# Altium project Minion_Rev2.PrjPCB (part 5 of 5)

## Sheet VDD_GND.SchDoc
size E
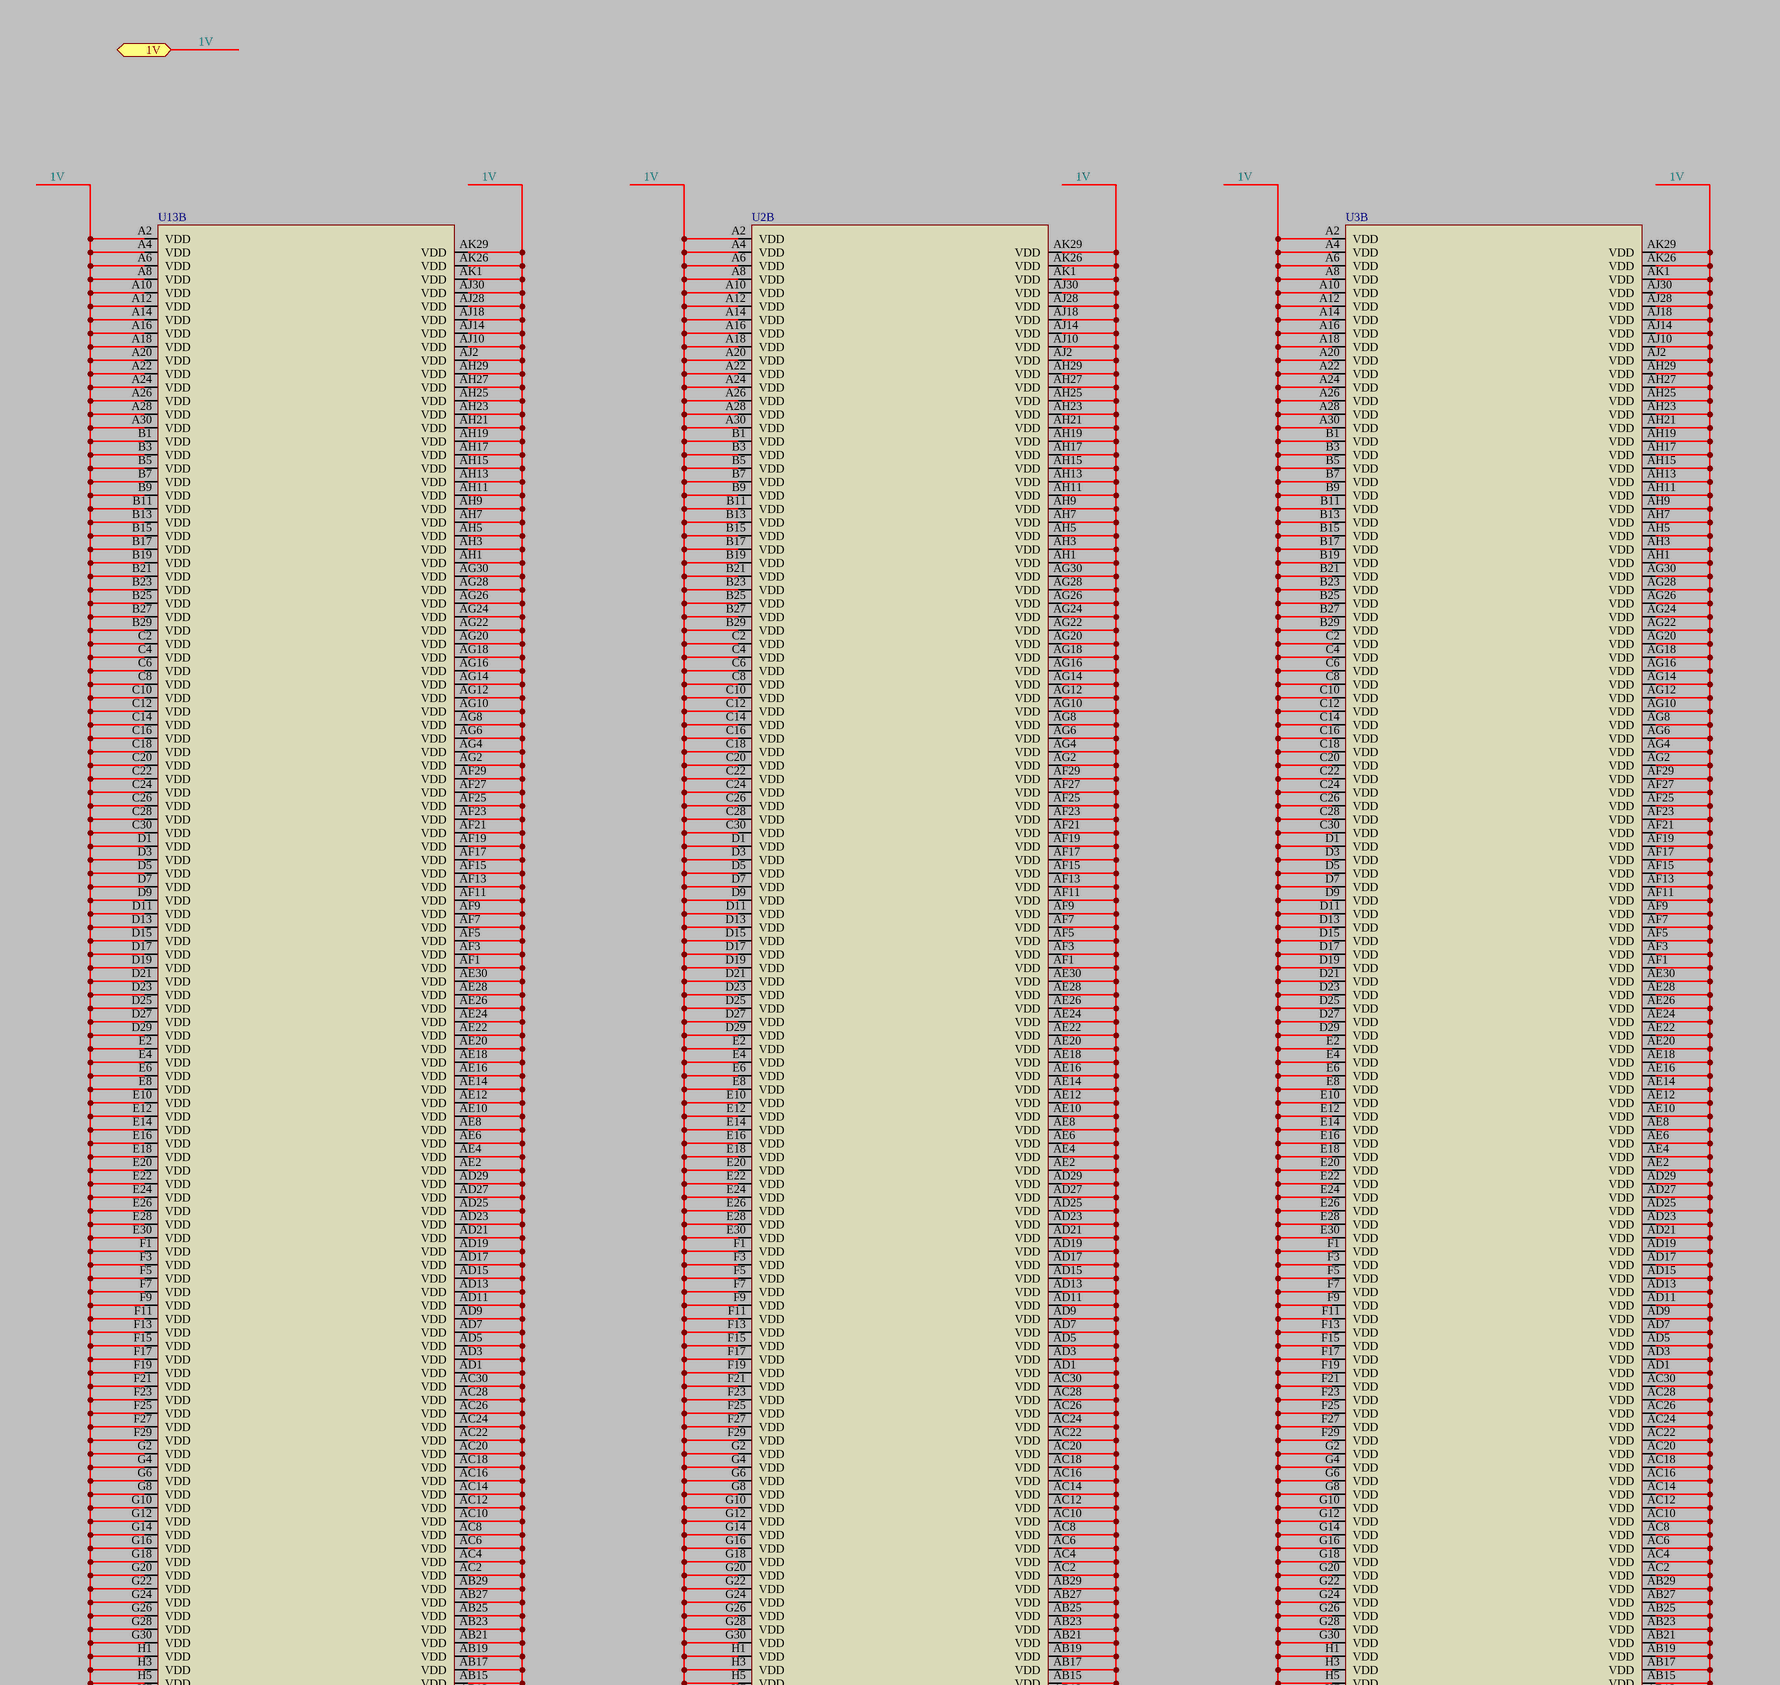
[diagram p10: VDD_GND.SchDoc, top left]
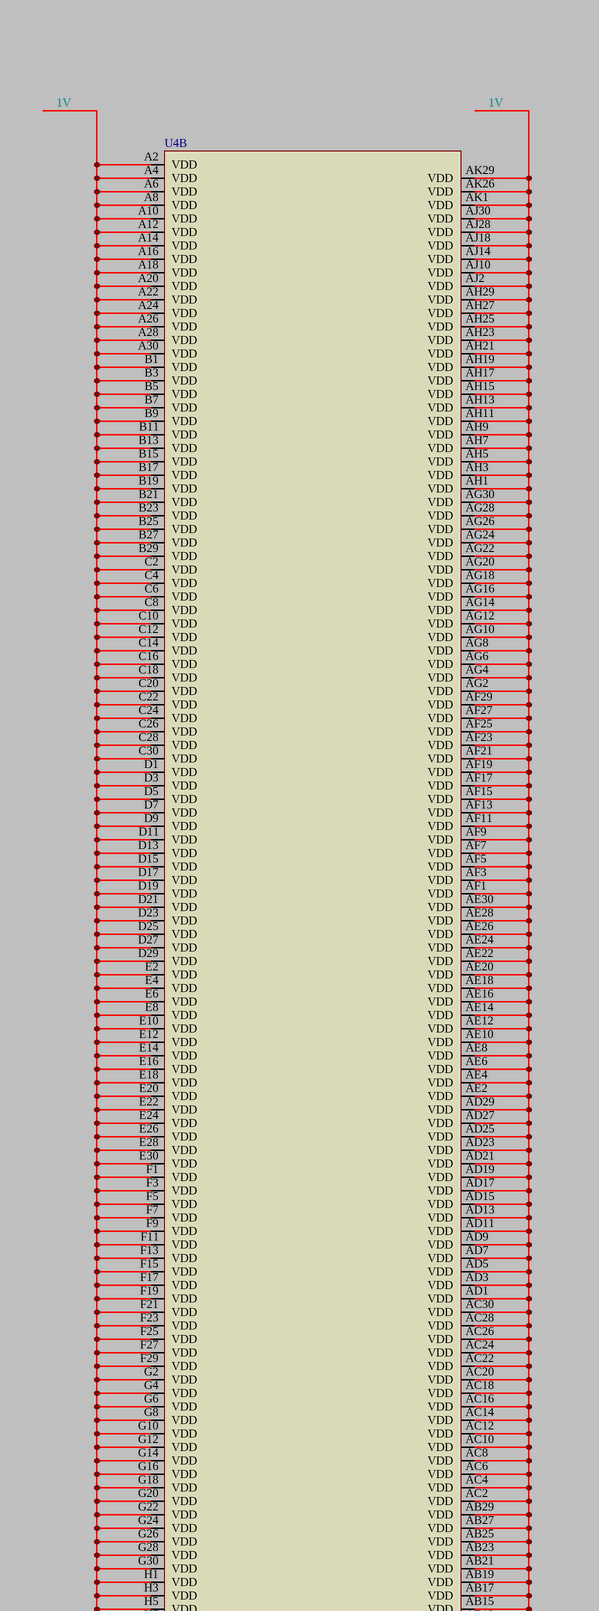
[diagram p11: VDD_GND.SchDoc, top middle]
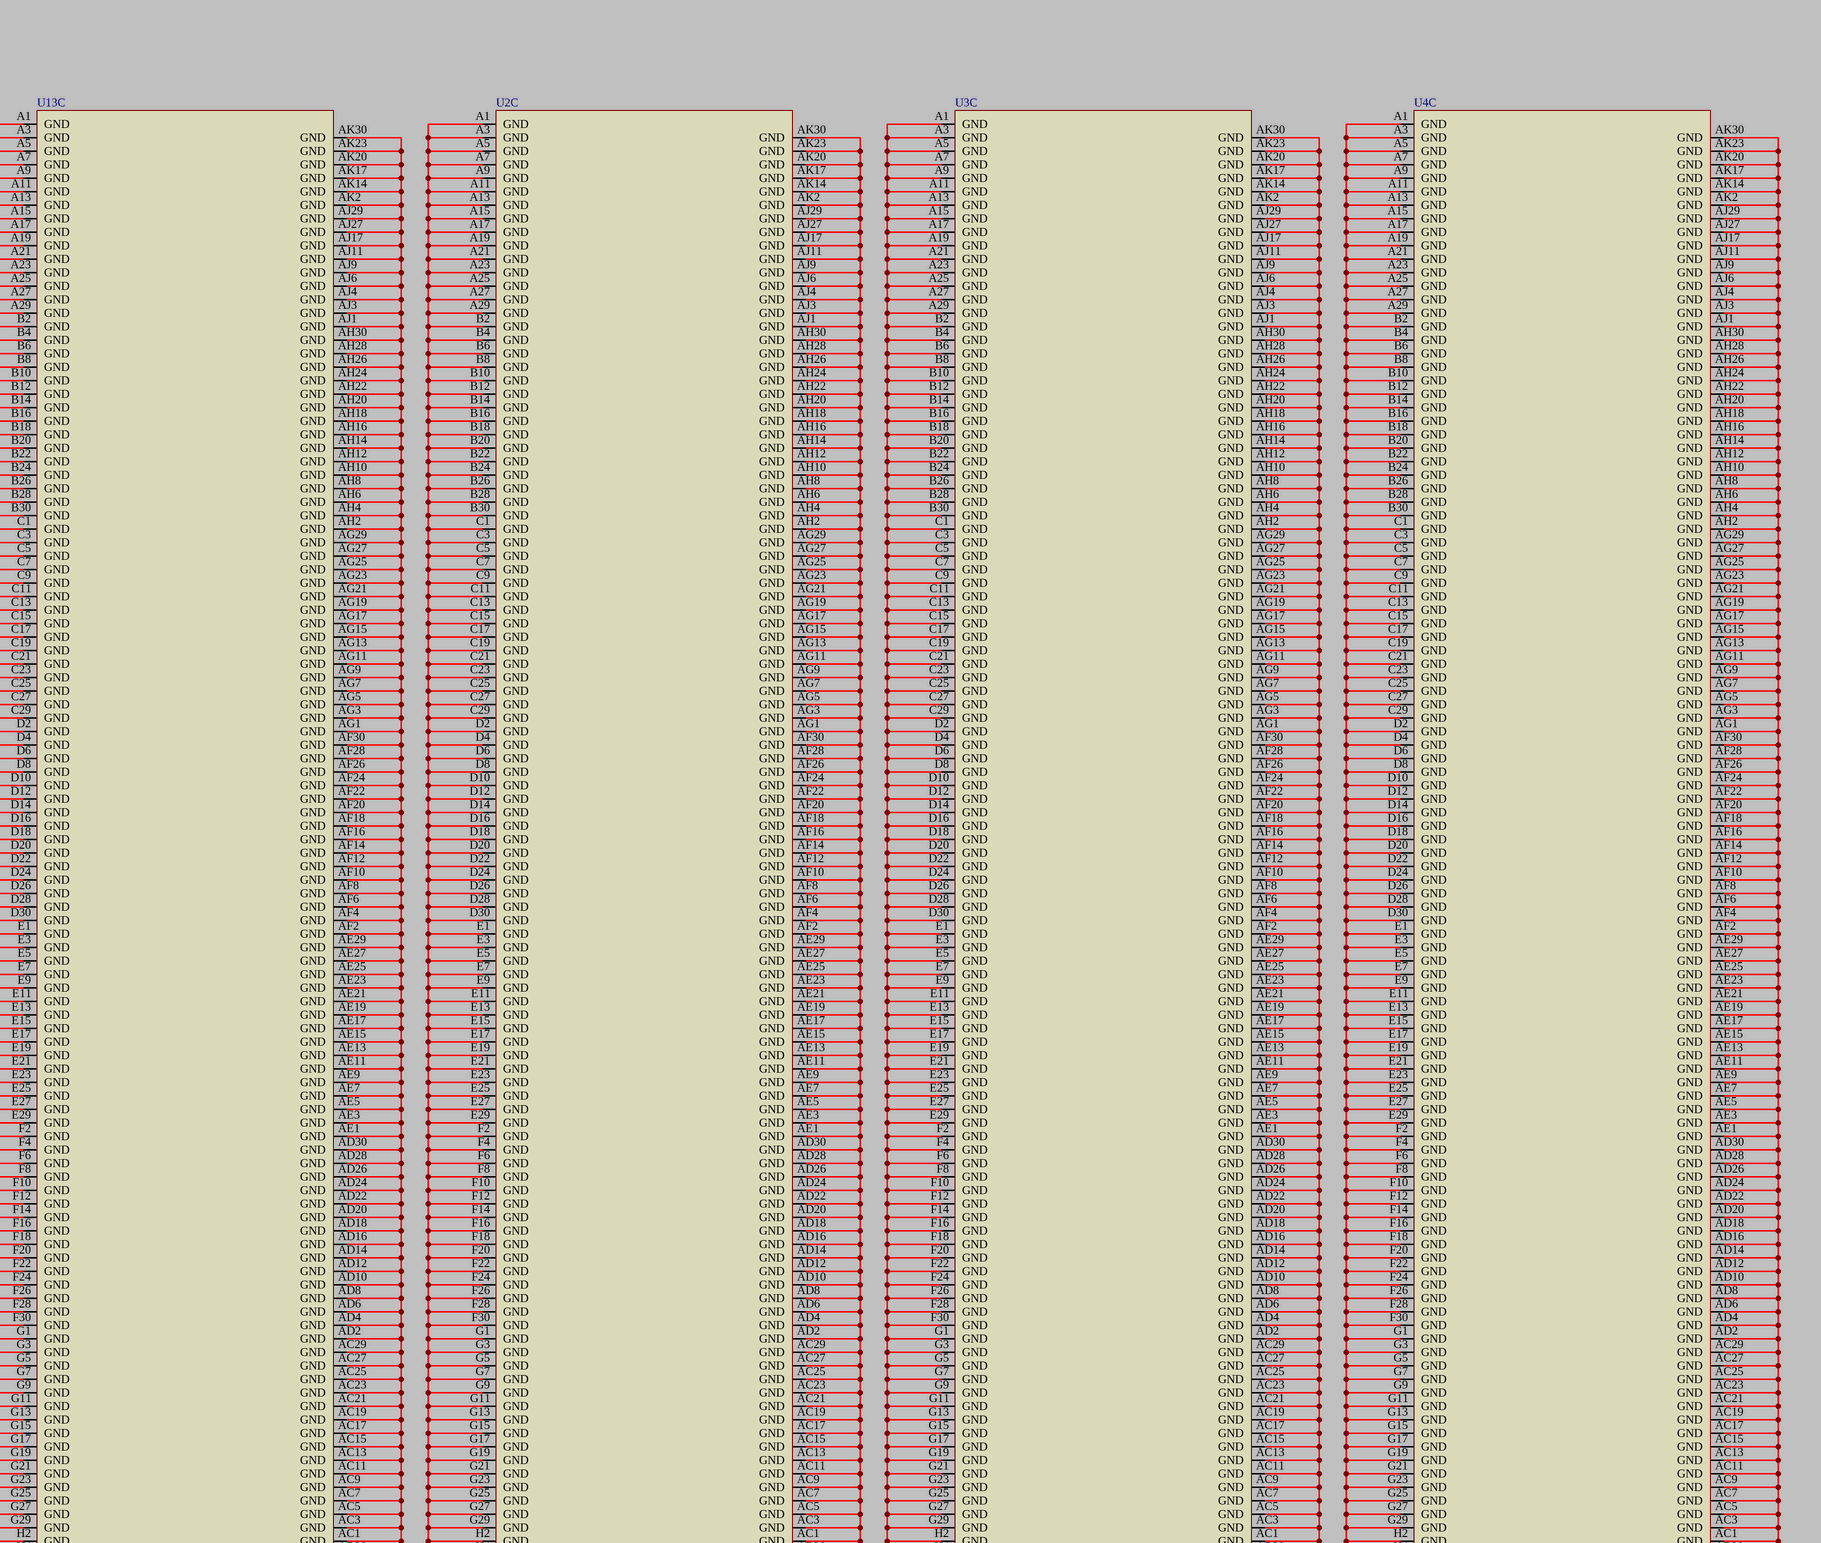
[diagram p12: VDD_GND.SchDoc, top right]
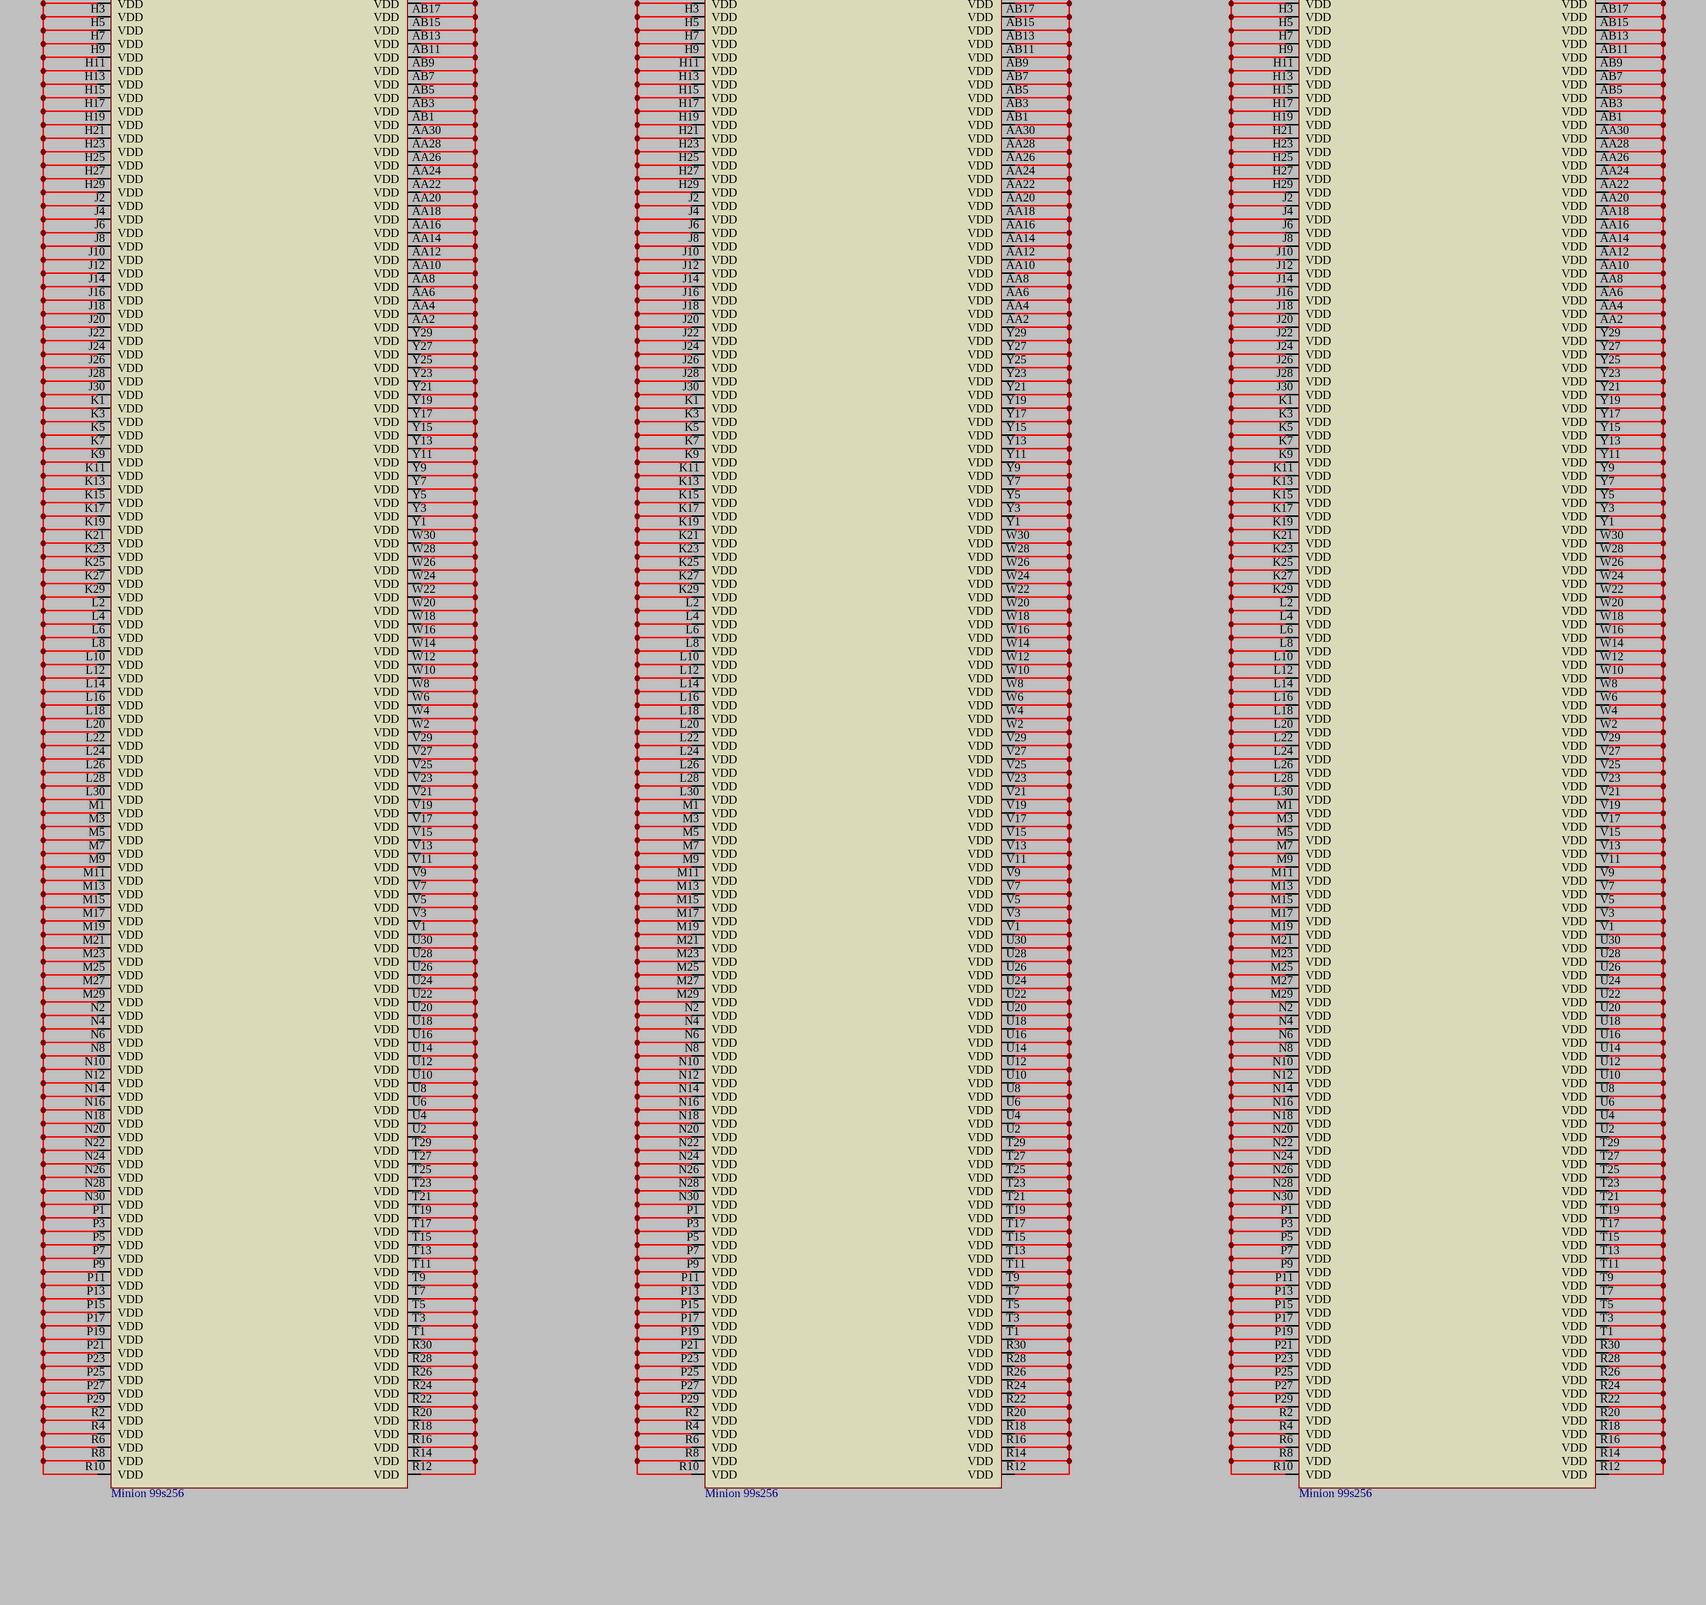
[diagram p13: VDD_GND.SchDoc, bottom left]
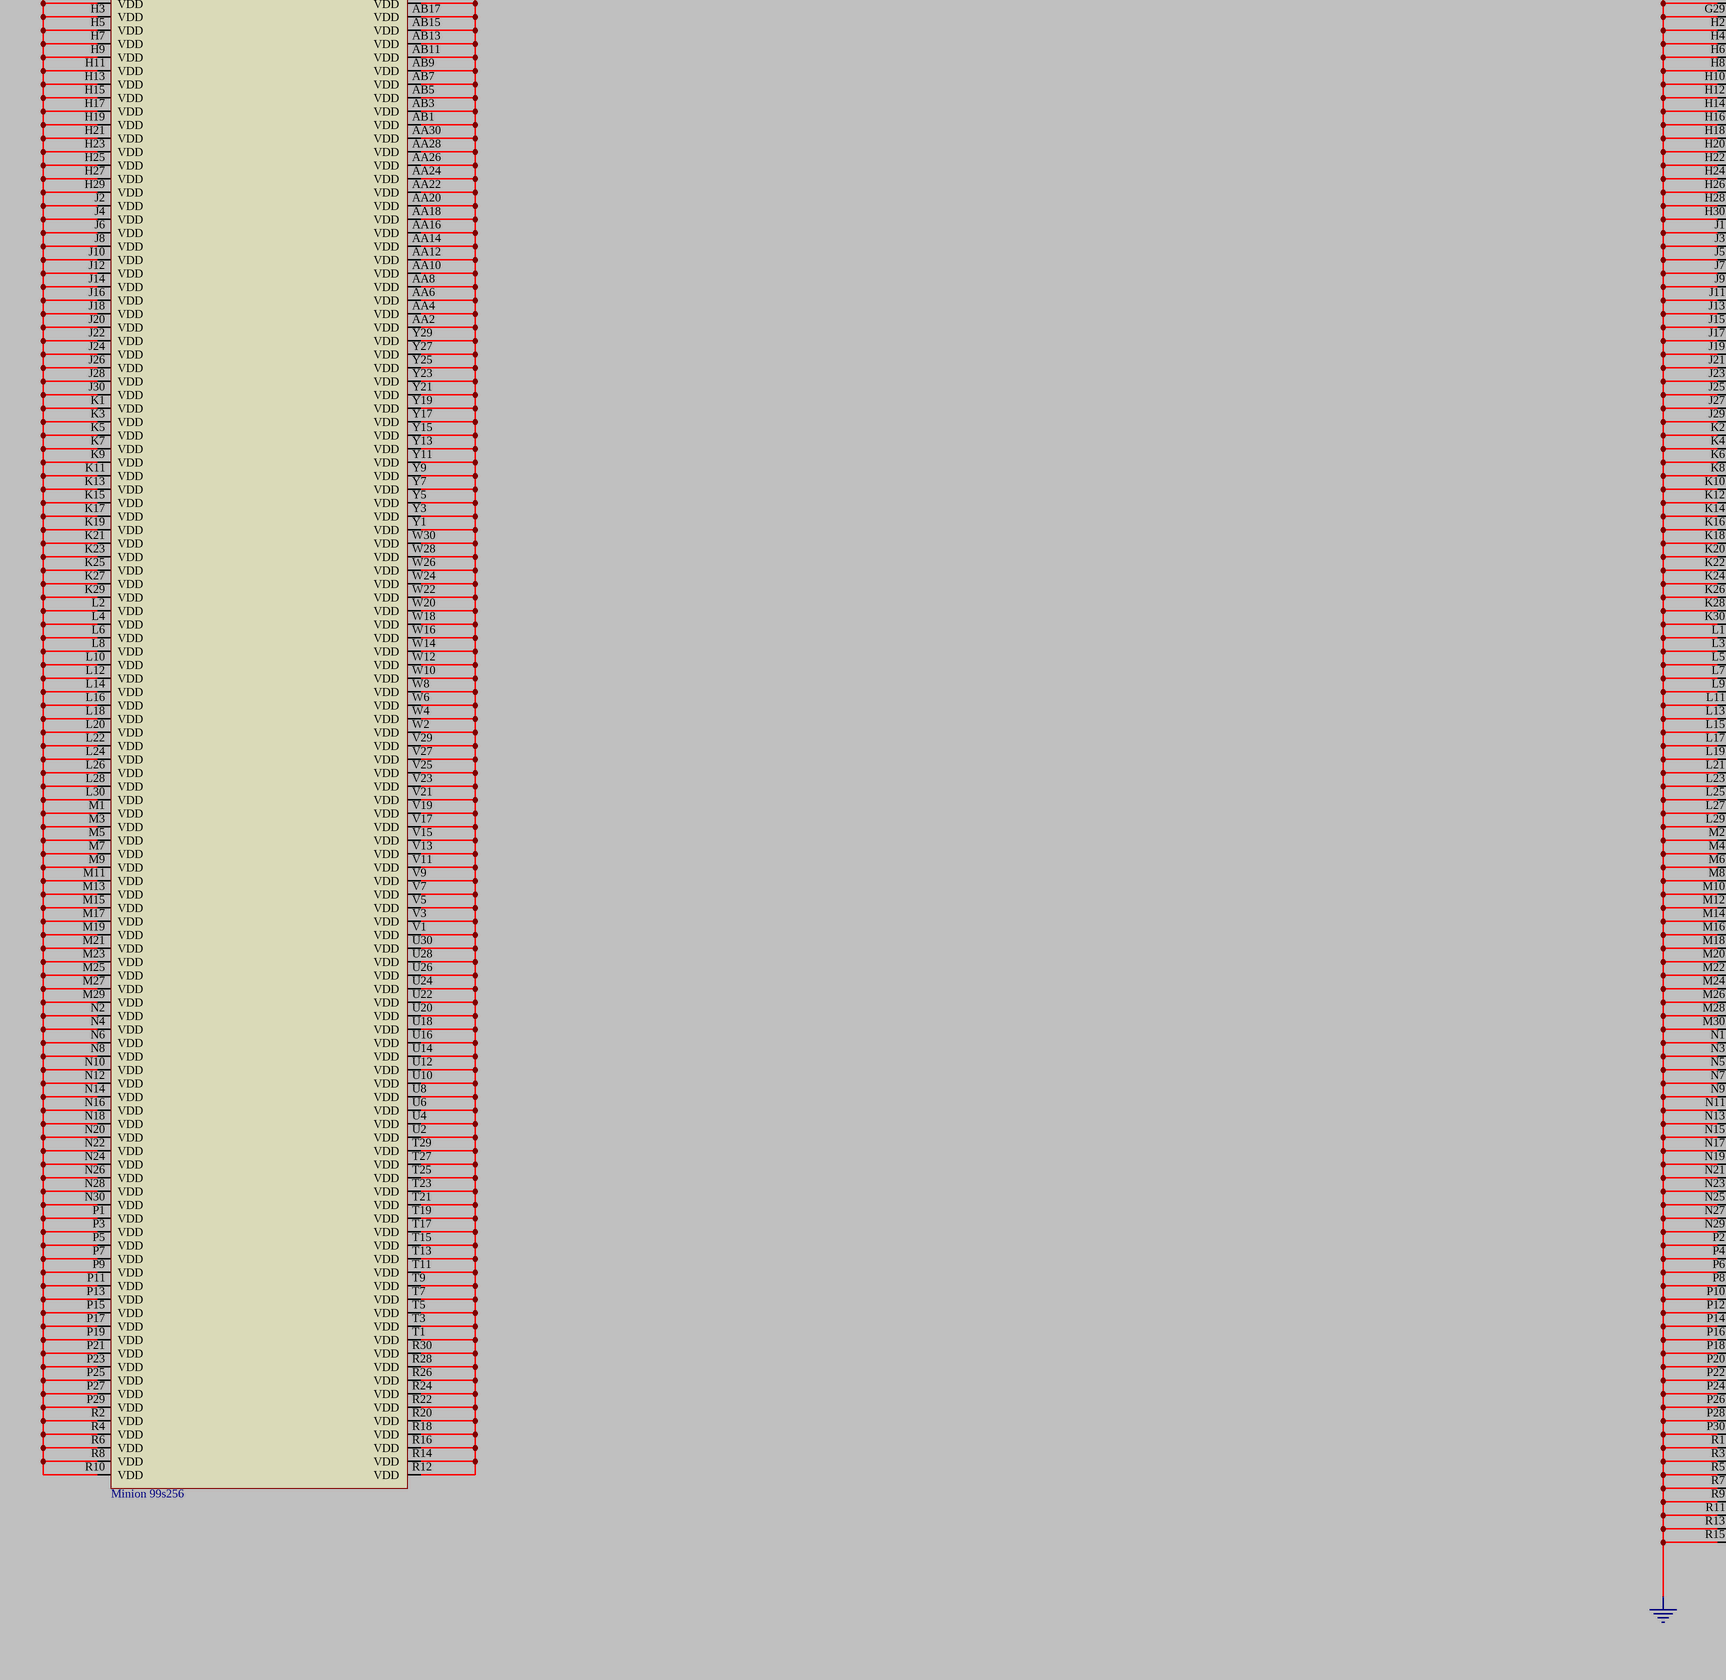
[diagram p14: VDD_GND.SchDoc, bottom middle]
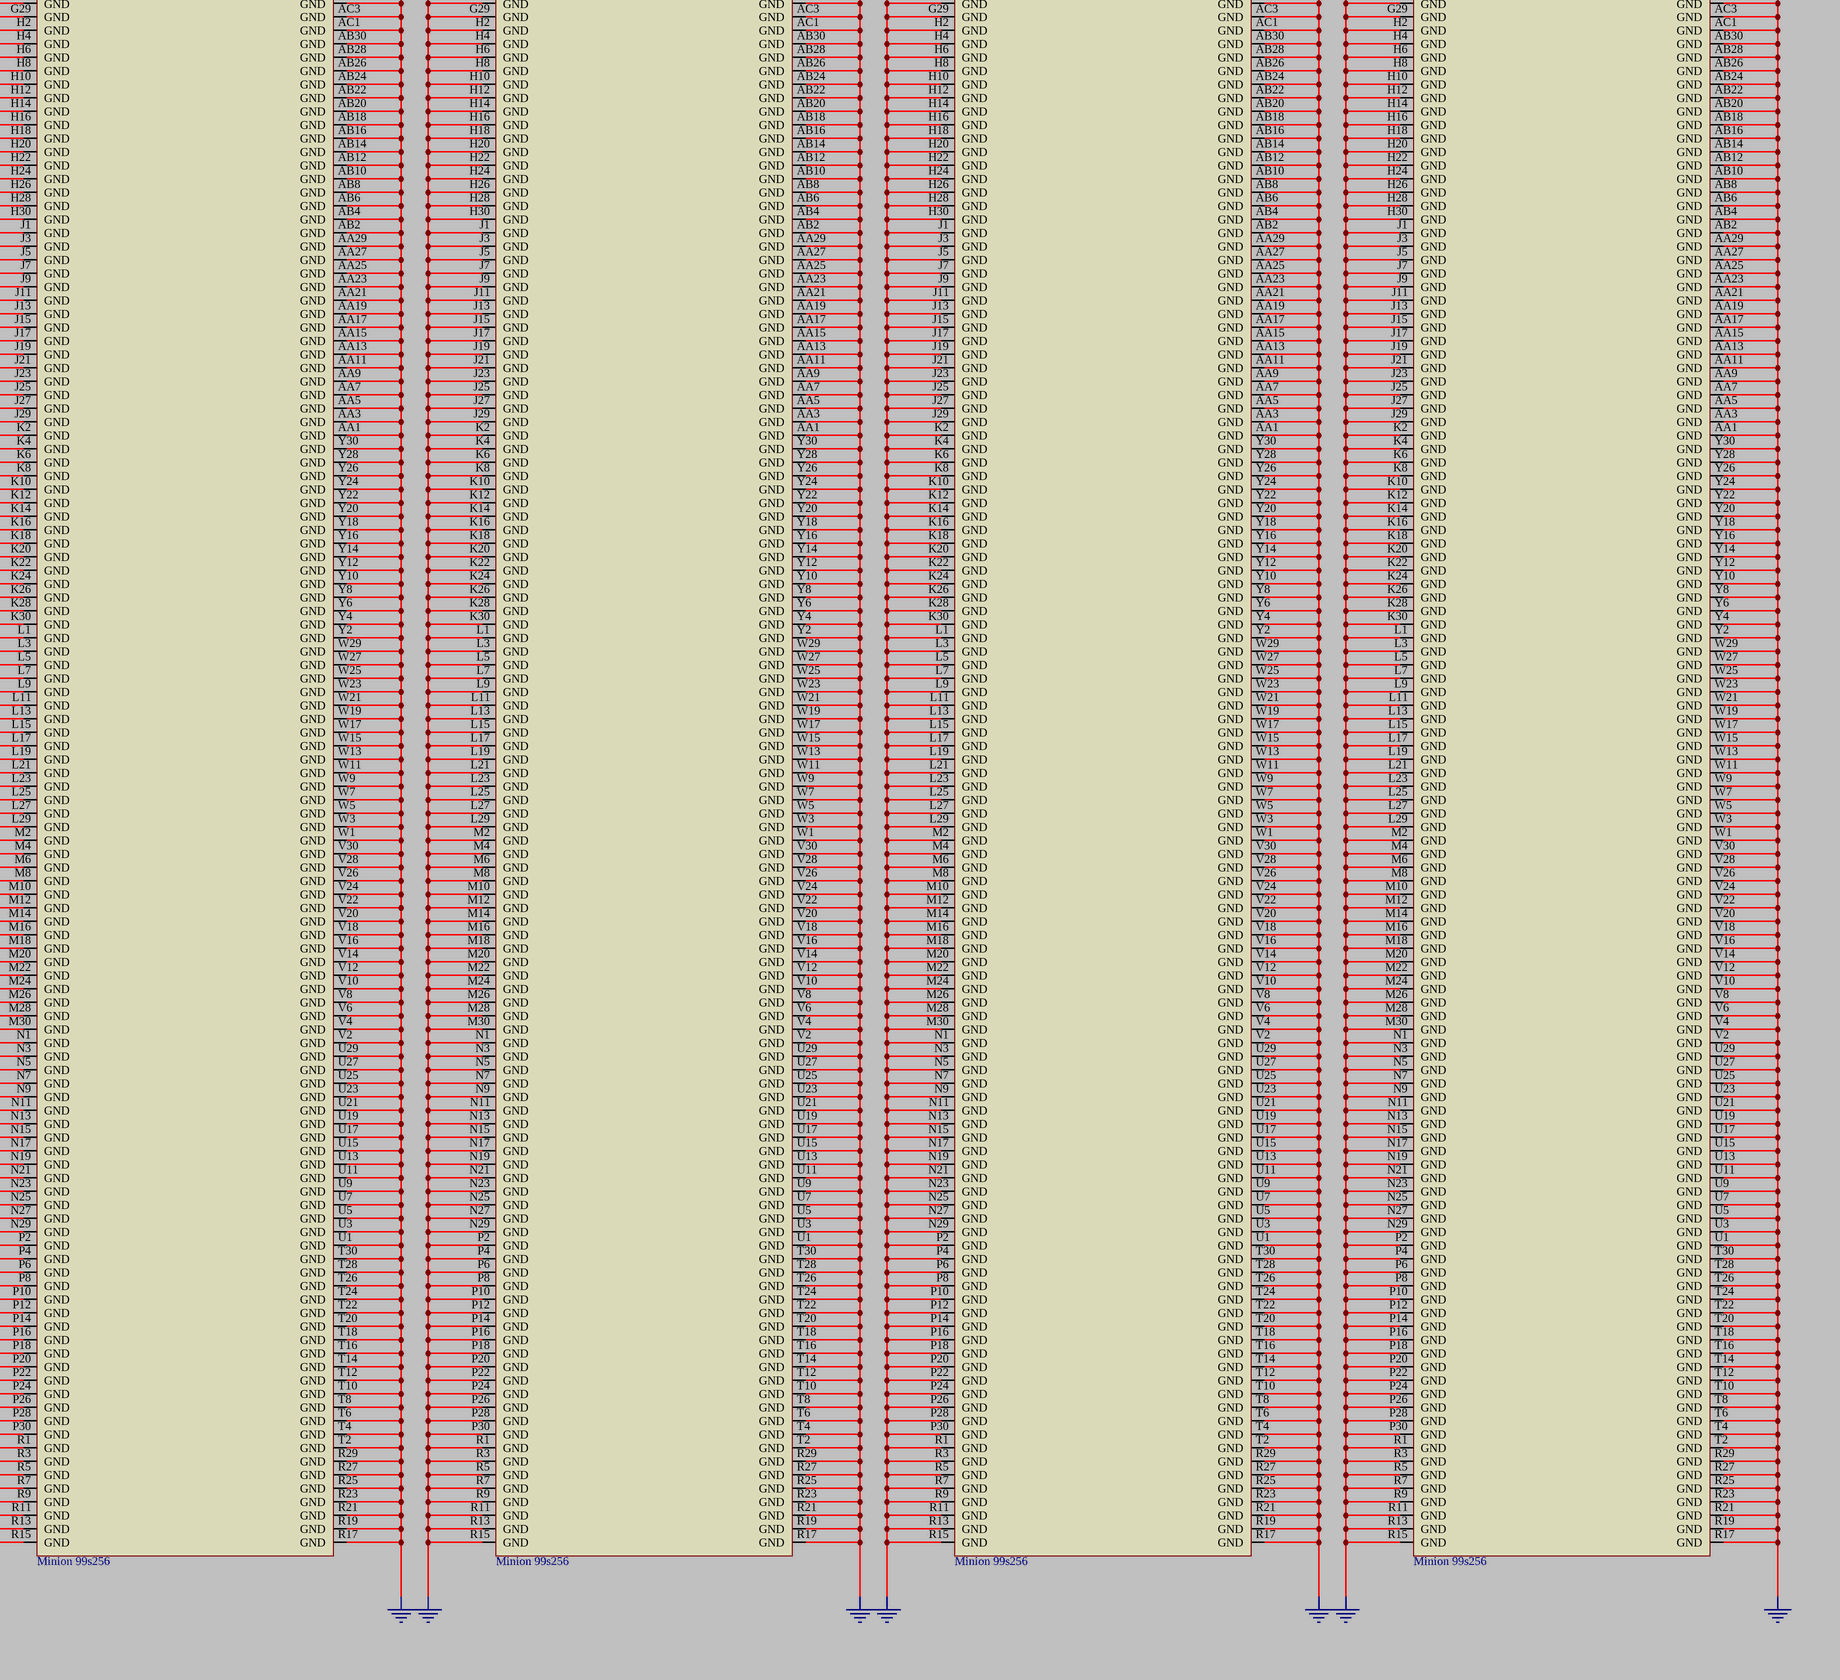
[diagram p15: VDD_GND.SchDoc, bottom right]

### Parts
U2  Minion 99s256  [SMD_BGA900C80P30X30]  (parts B,C of 3)
U3  Minion 99s256  [SMD_BGA900C80P30X30]  (parts B,C of 3)
U4  Minion 99s256  [SMD_BGA900C80P30X30]  (parts B,C of 3)
U13  Minion 99s256  [SMD_BGA900C80P30X30]  (parts B,C of 3)

### Ports
1V

### Nets
GND: U2.A1(GND) U2.A3(GND) U2.A5(GND) U2.A7(GND) U2.A9(GND) U2.A11(GND) U2.A13(GND) U2.A15(GND) U2.A17(GND) U2.A19(GND) U2.A21(GND) U2.A23(GND) U2.A25(GND) U2.A27(GND) U2.A29(GND) U2.AA1(GND) U2.AA3(GND) U2.AA5(GND) U2.AA7(GND) U2.AA9(GND) U2.AA11(GND) U2.AA13(GND) U2.AA15(GND) U2.AA17(GND) U2.AA19(GND) U2.AA21(GND) U2.AA23(GND) U2.AA25(GND) U2.AA27(GND) U2.AA29(GND) U2.AB2(GND) U2.AB4(GND) U2.AB6(GND) U2.AB8(GND) U2.AB10(GND) U2.AB12(GND) U2.AB14(GND) U2.AB16(GND) U2.AB18(GND) U2.AB20(GND) U2.AB22(GND) U2.AB24(GND) U2.AB26(GND) U2.AB28(GND) U2.AB30(GND) U2.AC1(GND) U2.AC3(GND) U2.AC5(GND) U2.AC7(GND) U2.AC9(GND) U2.AC11(GND) U2.AC13(GND) U2.AC15(GND) U2.AC17(GND) U2.AC19(GND) U2.AC21(GND) U2.AC23(GND) U2.AC25(GND) U2.AC27(GND) U2.AC29(GND) U2.AD2(GND) U2.AD4(GND) U2.AD6(GND) U2.AD8(GND) U2.AD10(GND) U2.AD12(GND) U2.AD14(GND) U2.AD16(GND) U2.AD18(GND) U2.AD20(GND) U2.AD22(GND) U2.AD24(GND) U2.AD26(GND) U2.AD28(GND) U2.AD30(GND) U2.AE1(GND) U2.AE3(GND) U2.AE5(GND) U2.AE7(GND) U2.AE9(GND) U2.AE11(GND) U2.AE13(GND) U2.AE15(GND) U2.AE17(GND) U2.AE19(GND) U2.AE21(GND) U2.AE23(GND) U2.AE25(GND) U2.AE27(GND) U2.AE29(GND) U2.AF2(GND) U2.AF4(GND) U2.AF6(GND) U2.AF8(GND) U2.AF10(GND) U2.AF12(GND) U2.AF14(GND) U2.AF16(GND) U2.AF18(GND) U2.AF20(GND) U2.AF22(GND) U2.AF24(GND) U2.AF26(GND) U2.AF28(GND) U2.AF30(GND) U2.AG1(GND) U2.AG3(GND) U2.AG5(GND) U2.AG7(GND) U2.AG9(GND) U2.AG11(GND) U2.AG13(GND) U2.AG15(GND) U2.AG17(GND) U2.AG19(GND) U2.AG21(GND) U2.AG23(GND) U2.AG25(GND) U2.AG27(GND) U2.AG29(GND) U2.AH2(GND) U2.AH4(GND) U2.AH6(GND) U2.AH8(GND) U2.AH10(GND) U2.AH12(GND) U2.AH14(GND) U2.AH16(GND) U2.AH18(GND) U2.AH20(GND) U2.AH22(GND) U2.AH24(GND) U2.AH26(GND) U2.AH28(GND) U2.AH30(GND) U2.AJ1(GND) U2.AJ3(GND) U2.AJ4(GND) U2.AJ6(GND) U2.AJ9(GND) U2.AJ11(GND) U2.AJ17(GND) U2.AJ27(GND) U2.AJ29(GND) U2.AK2(GND) U2.AK14(GND) U2.AK17(GND) U2.AK20(GND) U2.AK23(GND) U2.AK30(GND) U2.B2(GND) U2.B4(GND) U2.B6(GND) U2.B8(GND) U2.B10(GND) U2.B12(GND) U2.B14(GND) U2.B16(GND) U2.B18(GND) U2.B20(GND) U2.B22(GND) U2.B24(GND) U2.B26(GND) U2.B28(GND) U2.B30(GND) U2.C1(GND) U2.C3(GND) U2.C5(GND) U2.C7(GND) U2.C9(GND) U2.C11(GND) U2.C13(GND) U2.C15(GND) U2.C17(GND) U2.C19(GND) U2.C21(GND) U2.C23(GND) U2.C25(GND) U2.C27(GND) U2.C29(GND) U2.D2(GND) U2.D4(GND) U2.D6(GND) U2.D8(GND) U2.D10(GND) U2.D12(GND) U2.D14(GND) U2.D16(GND) U2.D18(GND) U2.D20(GND) U2.D22(GND) U2.D24(GND) U2.D26(GND) U2.D28(GND) U2.D30(GND) U2.E1(GND) U2.E3(GND) U2.E5(GND) U2.E7(GND) U2.E9(GND) U2.E11(GND) U2.E13(GND) U2.E15(GND) U2.E17(GND) U2.E19(GND) U2.E21(GND) U2.E23(GND) U2.E25(GND) U2.E27(GND) U2.E29(GND) U2.F2(GND) U2.F4(GND) U2.F6(GND) U2.F8(GND) U2.F10(GND) U2.F12(GND) U2.F14(GND) U2.F16(GND) U2.F18(GND) U2.F20(GND) U2.F22(GND) U2.F24(GND) U2.F26(GND) U2.F28(GND) U2.F30(GND) U2.G1(GND) U2.G3(GND) U2.G5(GND) U2.G7(GND) U2.G9(GND) U2.G11(GND) U2.G13(GND) U2.G15(GND) U2.G17(GND) U2.G19(GND) U2.G21(GND) U2.G23(GND) U2.G25(GND) U2.G27(GND) U2.G29(GND) U2.H2(GND) U2.H4(GND) U2.H6(GND) U2.H8(GND) U2.H10(GND) U2.H12(GND) U2.H14(GND) U2.H16(GND) U2.H18(GND) U2.H20(GND) U2.H22(GND) U2.H24(GND) U2.H26(GND) U2.H28(GND) U2.H30(GND) U2.J1(GND) U2.J3(GND) U2.J5(GND) U2.J7(GND) U2.J9(GND) U2.J11(GND) U2.J13(GND) U2.J15(GND) U2.J17(GND) U2.J19(GND) U2.J21(GND) U2.J23(GND) U2.J25(GND) U2.J27(GND) U2.J29(GND) U2.K2(GND) U2.K4(GND) U2.K6(GND) U2.K8(GND) U2.K10(GND) U2.K12(GND) U2.K14(GND) U2.K16(GND) U2.K18(GND) U2.K20(GND) U2.K22(GND) U2.K24(GND) U2.K26(GND) U2.K28(GND) U2.K30(GND) U2.L1(GND) U2.L3(GND) U2.L5(GND) U2.L7(GND) U2.L9(GND) U2.L11(GND) U2.L13(GND) U2.L15(GND) U2.L17(GND) U2.L19(GND) U2.L21(GND) U2.L23(GND) U2.L25(GND) U2.L27(GND) U2.L29(GND) U2.M2(GND) U2.M4(GND) U2.M6(GND) U2.M8(GND) U2.M10(GND) U2.M12(GND) U2.M14(GND) U2.M16(GND) U2.M18(GND) U2.M20(GND) U2.M22(GND) U2.M24(GND) U2.M26(GND) U2.M28(GND) U2.M30(GND) U2.N1(GND) U2.N3(GND) U2.N5(GND) U2.N7(GND) U2.N9(GND) U2.N11(GND) U2.N13(GND) U2.N15(GND) U2.N17(GND) U2.N19(GND) U2.N21(GND) U2.N23(GND) U2.N25(GND) U2.N27(GND) U2.N29(GND) U2.P2(GND) U2.P4(GND) U2.P6(GND) U2.P8(GND) U2.P10(GND) U2.P12(GND) U2.P14(GND) U2.P16(GND) U2.P18(GND) U2.P20(GND) U2.P22(GND) U2.P24(GND) U2.P26(GND) U2.P28(GND) U2.P30(GND) U2.R1(GND) U2.R3(GND) U2.R5(GND) U2.R7(GND) U2.R9(GND) U2.R11(GND) U2.R13(GND) U2.R15(GND) U2.R17(GND) U2.R19(GND) U2.R21(GND) U2.R23(GND) U2.R25(GND) U2.R27(GND) U2.R29(GND) U2.T2(GND) U2.T4(GND) U2.T6(GND) U2.T8(GND) U2.T10(GND) U2.T12(GND) U2.T14(GND) U2.T16(GND) U2.T18(GND) U2.T20(GND) U2.T22(GND) U2.T24(GND) U2.T26(GND) U2.T28(GND) U2.T30(GND) U2.U1(GND) U2.U3(GND) U2.U5(GND) U2.U7(GND) U2.U9(GND) U2.U11(GND) U2.U13(GND) U2.U15(GND) U2.U17(GND) U2.U19(GND) U2.U21(GND) U2.U23(GND) U2.U25(GND) U2.U27(GND) U2.U29(GND) U2.V2(GND) U2.V4(GND) U2.V6(GND) U2.V8(GND) U2.V10(GND) U2.V12(GND) U2.V14(GND) U2.V16(GND) U2.V18(GND) U2.V20(GND) U2.V22(GND) U2.V24(GND) U2.V26(GND) U2.V28(GND) U2.V30(GND) U2.W1(GND) U2.W3(GND) U2.W5(GND) U2.W7(GND) U2.W9(GND) U2.W11(GND) U2.W13(GND) U2.W15(GND) U2.W17(GND) U2.W19(GND) U2.W21(GND) U2.W23(GND) U2.W25(GND) U2.W27(GND) U2.W29(GND) U2.Y2(GND) U2.Y4(GND) U2.Y6(GND) U2.Y8(GND) U2.Y10(GND) U2.Y12(GND) U2.Y14(GND) U2.Y16(GND) U2.Y18(GND) U2.Y20(GND) U2.Y22(GND) U2.Y24(GND) U2.Y26(GND) U2.Y28(GND) U2.Y30(GND) U3.A1(GND) U3.A3(GND) U3.A5(GND) U3.A7(GND) U3.A9(GND) U3.A11(GND) U3.A13(GND) U3.A15(GND) U3.A17(GND) U3.A19(GND) U3.A21(GND) U3.A23(GND) U3.A25(GND) U3.A27(GND) U3.A29(GND) U3.AA1(GND) U3.AA3(GND) U3.AA5(GND) U3.AA7(GND) U3.AA9(GND) U3.AA11(GND) U3.AA13(GND) U3.AA15(GND) U3.AA17(GND) U3.AA19(GND) U3.AA21(GND) U3.AA23(GND) U3.AA25(GND) U3.AA27(GND) U3.AA29(GND) U3.AB2(GND) U3.AB4(GND) U3.AB6(GND) U3.AB8(GND) U3.AB10(GND) U3.AB12(GND) U3.AB14(GND) U3.AB16(GND) U3.AB18(GND) U3.AB20(GND) U3.AB22(GND) U3.AB24(GND) U3.AB26(GND) U3.AB28(GND) U3.AB30(GND) U3.AC1(GND) U3.AC3(GND) U3.AC5(GND) U3.AC7(GND) U3.AC9(GND) U3.AC11(GND) U3.AC13(GND) U3.AC15(GND) U3.AC17(GND) U3.AC19(GND) U3.AC21(GND) U3.AC23(GND) U3.AC25(GND) U3.AC27(GND) U3.AC29(GND) U3.AD2(GND) U3.AD4(GND) U3.AD6(GND) U3.AD8(GND) U3.AD10(GND) U3.AD12(GND) U3.AD14(GND) U3.AD16(GND) U3.AD18(GND) U3.AD20(GND) U3.AD22(GND) U3.AD24(GND) U3.AD26(GND) U3.AD28(GND) U3.AD30(GND) U3.AE1(GND) U3.AE3(GND) U3.AE5(GND) U3.AE7(GND) U3.AE9(GND) U3.AE11(GND) U3.AE13(GND) U3.AE15(GND) U3.AE17(GND) U3.AE19(GND) U3.AE21(GND) U3.AE23(GND) U3.AE25(GND) U3.AE27(GND) U3.AE29(GND) U3.AF2(GND) U3.AF4(GND) U3.AF6(GND) U3.AF8(GND) U3.AF10(GND) U3.AF12(GND) U3.AF14(GND) U3.AF16(GND) U3.AF18(GND) U3.AF20(GND) U3.AF22(GND) U3.AF24(GND) U3.AF26(GND) U3.AF28(GND) U3.AF30(GND) U3.AG1(GND) U3.AG3(GND) U3.AG5(GND) U3.AG7(GND) U3.AG9(GND) U3.AG11(GND) U3.AG13(GND) U3.AG15(GND) U3.AG17(GND) U3.AG19(GND) U3.AG21(GND) U3.AG23(GND) U3.AG25(GND) U3.AG27(GND) U3.AG29(GND) U3.AH2(GND) U3.AH4(GND) U3.AH6(GND) U3.AH8(GND) U3.AH10(GND) U3.AH12(GND) U3.AH14(GND) U3.AH16(GND) U3.AH18(GND) U3.AH20(GND) U3.AH22(GND) U3.AH24(GND) U3.AH26(GND) U3.AH28(GND) U3.AH30(GND) U3.AJ1(GND) U3.AJ3(GND) U3.AJ4(GND) U3.AJ6(GND) U3.AJ9(GND) U3.AJ11(GND) U3.AJ17(GND) U3.AJ27(GND) U3.AJ29(GND) U3.AK2(GND) U3.AK14(GND) U3.AK17(GND) U3.AK20(GND) U3.AK23(GND) U3.AK30(GND) U3.B2(GND) U3.B4(GND) U3.B6(GND) U3.B8(GND) U3.B10(GND) U3.B12(GND) U3.B14(GND) U3.B16(GND) U3.B18(GND) U3.B20(GND) U3.B22(GND) U3.B24(GND) U3.B26(GND) U3.B28(GND) U3.B30(GND) U3.C1(GND) U3.C3(GND) U3.C5(GND) U3.C7(GND) U3.C9(GND) U3.C11(GND) U3.C13(GND) U3.C15(GND) U3.C17(GND) U3.C19(GND) U3.C21(GND) U3.C23(GND) U3.C25(GND) U3.C27(GND) U3.C29(GND) U3.D2(GND) U3.D4(GND) U3.D6(GND) U3.D8(GND) U3.D10(GND) U3.D12(GND) U3.D14(GND) U3.D16(GND) U3.D18(GND) U3.D20(GND) U3.D22(GND) U3.D24(GND) U3.D26(GND) U3.D28(GND) U3.D30(GND) U3.E1(GND) U3.E3(GND) U3.E5(GND) U3.E7(GND) U3.E9(GND) U3.E11(GND) U3.E13(GND) U3.E15(GND) U3.E17(GND) U3.E19(GND) U3.E21(GND) U3.E23(GND) U3.E25(GND) U3.E27(GND) U3.E29(GND) U3.F2(GND) U3.F4(GND) U3.F6(GND) U3.F8(GND) U3.F10(GND) U3.F12(GND) U3.F14(GND) U3.F16(GND) U3.F18(GND) U3.F20(GND) U3.F22(GND) U3.F24(GND) U3.F26(GND) U3.F28(GND) U3.F30(GND) U3.G1(GND) U3.G3(GND) U3.G5(GND) U3.G7(GND) U3.G9(GND) U3.G11(GND) U3.G13(GND) U3.G15(GND) U3.G17(GND) U3.G19(GND) U3.G21(GND) U3.G23(GND) U3.G25(GND) U3.G27(GND) U3.G29(GND) U3.H2(GND) U3.H4(GND) U3.H6(GND) U3.H8(GND) U3.H10(GND) U3.H12(GND) U3.H14(GND) U3.H16(GND) U3.H18(GND) U3.H20(GND) U3.H22(GND) U3.H24(GND) U3.H26(GND) U3.H28(GND) U3.H30(GND) U3.J1(GND) U3.J3(GND) U3.J5(GND) U3.J7(GND) U3.J9(GND) U3.J11(GND) U3.J13(GND) U3.J15(GND) U3.J17(GND) U3.J19(GND) U3.J21(GND) U3.J23(GND) U3.J25(GND) U3.J27(GND) U3.J29(GND) U3.K2(GND) U3.K4(GND) U3.K6(GND) U3.K8(GND) U3.K10(GND) U3.K12(GND) U3.K14(GND) U3.K16(GND) U3.K18(GND) U3.K20(GND) U3.K22(GND) U3.K24(GND) U3.K26(GND) U3.K28(GND) U3.K30(GND) U3.L1(GND) U3.L3(GND) U3.L5(GND) U3.L7(GND) U3.L9(GND) U3.L11(GND) U3.L13(GND) U3.L15(GND) U3.L17(GND) U3.L19(GND) U3.L21(GND) U3.L23(GND) U3.L25(GND) U3.L27(GND) U3.L29(GND) U3.M2(GND) U3.M4(GND) U3.M6(GND) U3.M8(GND) U3.M10(GND) U3.M12(GND) U3.M14(GND) U3.M16(GND) U3.M18(GND) U3.M20(GND) U3.M22(GND) U3.M24(GND) U3.M26(GND) U3.M28(GND) U3.M30(GND) U3.N1(GND) U3.N3(GND) U3.N5(GND) U3.N7(GND) U3.N9(GND) U3.N11(GND) U3.N13(GND) U3.N15(GND) U3.N17(GND) U3.N19(GND) U3.N21(GND) U3.N23(GND) U3.N25(GND) U3.N27(GND) U3.N29(GND) U3.P2(GND) U3.P4(GND) U3.P6(GND) U3.P8(GND) U3.P10(GND) U3.P12(GND) U3.P14(GND) U3.P16(GND) U3.P18(GND) U3.P20(GND) U3.P22(GND) U3.P24(GND) U3.P26(GND) U3.P28(GND) U3.P30(GND) U3.R1(GND) U3.R3(GND) U3.R5(GND) U3.R7(GND) U3.R9(GND) U3.R11(GND) U3.R13(GND) U3.R15(GND) U3.R17(GND) U3.R19(GND) U3.R21(GND) U3.R23(GND) U3.R25(GND) U3.R27(GND) U3.R29(GND) U3.T2(GND) U3.T4(GND) U3.T6(GND) U3.T8(GND) U3.T10(GND) U3.T12(GND) U3.T14(GND) U3.T16(GND) U3.T18(GND) U3.T20(GND) U3.T22(GND) U3.T24(GND) U3.T26(GND) U3.T28(GND) U3.T30(GND) U3.U1(GND) U3.U3(GND) U3.U5(GND) U3.U7(GND) U3.U9(GND) U3.U11(GND) U3.U13(GND) U3.U15(GND) U3.U17(GND) U3.U19(GND) U3.U21(GND) U3.U23(GND) U3.U25(GND) U3.U27(GND) U3.U29(GND) U3.V2(GND) U3.V4(GND) U3.V6(GND) U3.V8(GND) U3.V10(GND) U3.V12(GND) U3.V14(GND) U3.V16(GND) U3.V18(GND) U3.V20(GND) U3.V22(GND) U3.V24(GND) U3.V26(GND) U3.V28(GND) U3.V30(GND) U3.W1(GND) U3.W3(GND) U3.W5(GND) U3.W7(GND) U3.W9(GND) U3.W11(GND) U3.W13(GND) U3.W15(GND) U3.W17(GND) U3.W19(GND) U3.W21(GND) U3.W23(GND) U3.W25(GND) U3.W27(GND) U3.W29(GND) U3.Y2(GND) U3.Y4(GND) U3.Y6(GND) U3.Y8(GND) U3.Y10(GND) U3.Y12(GND) U3.Y14(GND) U3.Y16(GND) U3.Y18(GND) U3.Y20(GND) U3.Y22(GND) U3.Y24(GND) U3.Y26(GND) U3.Y28(GND) U3.Y30(GND) U4.A1(GND) U4.A3(GND) U4.A5(GND) U4.A7(GND) U4.A9(GND) U4.A11(GND) U4.A13(GND) U4.A15(GND) U4.A17(GND) U4.A19(GND) U4.A21(GND) U4.A23(GND) U4.A25(GND) U4.A27(GND) U4.A29(GND) U4.AA1(GND) U4.AA3(GND) U4.AA5(GND) U4.AA7(GND) U4.AA9(GND) U4.AA11(GND) U4.AA13(GND) U4.AA15(GND) U4.AA17(GND) U4.AA19(GND) U4.AA21(GND) U4.AA23(GND) U4.AA25(GND) U4.AA27(GND) U4.AA29(GND) U4.AB2(GND) U4.AB4(GND) U4.AB6(GND) U4.AB8(GND) U4.AB10(GND) U4.AB12(GND) U4.AB14(GND) U4.AB16(GND) U4.AB18(GND) U4.AB20(GND) U4.AB22(GND) U4.AB24(GND) U4.AB26(GND) U4.AB28(GND) U4.AB30(GND) U4.AC1(GND) U4.AC3(GND) U4.AC5(GND) U4.AC7(GND) U4.AC9(GND) U4.AC11(GND) U4.AC13(GND) U4.AC15(GND) U4.AC17(GND) U4.AC19(GND) U4.AC21(GND) U4.AC23(GND) U4.AC25(GND) U4.AC27(GND) U4.AC29(GND) U4.AD2(GND) U4.AD4(GND) U4.AD6(GND) U4.AD8(GND) U4.AD10(GND) U4.AD12(GND) U4.AD14(GND) U4.AD16(GND) U4.AD18(GND) U4.AD20(GND) U4.AD22(GND) U4.AD24(GND) U4.AD26(GND) U4.AD28(GND) U4.AD30(GND) U4.AE1(GND) U4.AE3(GND) U4.AE5(GND) U4.AE7(GND) U4.AE9(GND) U4.AE11(GND) U4.AE13(GND) U4.AE15(GND) U4.AE17(GND) U4.AE19(GND) U4.AE21(GND) U4.AE23(GND) U4.AE25(GND) U4.AE27(GND) U4.AE29(GND) U4.AF2(GND) U4.AF4(GND) U4.AF6(GND) U4.AF8(GND) U4.AF10(GND) U4.AF12(GND) U4.AF14(GND) U4.AF16(GND) U4.AF18(GND) U4.AF20(GND) U4.AF22(GND) U4.AF24(GND) U4.AF26(GND) U4.AF28(GND) U4.AF30(GND) U4.AG1(GND) U4.AG3(GND) U4.AG5(GND) U4.AG7(GND) U4.AG9(GND) U4.AG11(GND) U4.AG13(GND) U4.AG15(GND) U4.AG17(GND) U4.AG19(GND) U4.AG21(GND) U4.AG23(GND) U4.AG25(GND) U4.AG27(GND) U4.AG29(GND) U4.AH2(GND) U4.AH4(GND) U4.AH6(GND) U4.AH8(GND) U4.AH10(GND) U4.AH12(GND) U4.AH14(GND) U4.AH16(GND) U4.AH18(GND) U4.AH20(GND) U4.AH22(GND) U4.AH24(GND) U4.AH26(GND) U4.AH28(GND) U4.AH30(GND) U4.AJ1(GND) U4.AJ3(GND) U4.AJ4(GND) U4.AJ6(GND) U4.AJ9(GND) U4.AJ11(GND) U4.AJ17(GND) U4.AJ27(GND) U4.AJ29(GND) U4.AK2(GND) U4.AK14(GND) U4.AK17(GND) U4.AK20(GND) U4.AK23(GND) U4.AK30(GND) U4.B2(GND) U4.B4(GND) U4.B6(GND) U4.B8(GND) U4.B10(GND) U4.B12(GND) U4.B14(GND) U4.B16(GND) U4.B18(GND) U4.B20(GND) U4.B22(GND) U4.B24(GND) U4.B26(GND) U4.B28(GND) U4.B30(GND) U4.C1(GND) U4.C3(GND) U4.C5(GND) U4.C7(GND) U4.C9(GND) U4.C11(GND) U4.C13(GND) U4.C15(GND) U4.C17(GND) U4.C19(GND) U4.C21(GND) U4.C23(GND) U4.C25(GND) U4.C27(GND) U4.C29(GND) U4.D2(GND) U4.D4(GND) U4.D6(GND) U4.D8(GND) U4.D10(GND) U4.D12(GND) U4.D14(GND) U4.D16(GND) U4.D18(GND) U4.D20(GND) U4.D22(GND) U4.D24(GND) U4.D26(GND) U4.D28(GND) U4.D30(GND) U4.E1(GND) U4.E3(GND) U4.E5(GND) U4.E7(GND) U4.E9(GND) U4.E11(GND) U4.E13(GND) U4.E15(GND) U4.E17(GND) U4.E19(GND) U4.E21(GND) U4.E23(GND) U4.E25(GND) U4.E27(GND) U4.E29(GND) U4.F2(GND) U4.F4(GND) U4.F6(GND) U4.F8(GND) U4.F10(GND) U4.F12(GND) U4.F14(GND) U4.F16(GND) U4.F18(GND) U4.F20(GND) U4.F22(GND) U4.F24(GND) U4.F26(GND) U4.F28(GND) U4.F30(GND) U4.G1(GND) U4.G3(GND) U4.G5(GND) U4.G7(GND) U4.G9(GND) U4.G11(GND) U4.G13(GND) U4.G15(GND) U4.G17(GND) U4.G19(GND) U4.G21(GND) U4.G23(GND) U4.G25(GND) U4.G27(GND) U4.G29(GND) U4.H2(GND) U4.H4(GND) U4.H6(GND) U4.H8(GND) U4.H10(GND) U4.H12(GND) U4.H14(GND) U4.H16(GND) U4.H18(GND) U4.H20(GND) U4.H22(GND) U4.H24(GND) U4.H26(GND) U4.H28(GND) U4.H30(GND) U4.J1(GND) U4.J3(GND) U4.J5(GND) U4.J7(GND) U4.J9(GND) U4.J11(GND) U4.J13(GND) U4.J15(GND) U4.J17(GND) U4.J19(GND) U4.J21(GND) U4.J23(GND) U4.J25(GND) U4.J27(GND) U4.J29(GND) U4.K2(GND) U4.K4(GND) U4.K6(GND) U4.K8(GND) U4.K10(GND) U4.K12(GND) U4.K14(GND) U4.K16(GND) U4.K18(GND) U4.K20(GND) U4.K22(GND) U4.K24(GND) U4.K26(GND) U4.K28(GND) U4.K30(GND) U4.L1(GND) U4.L3(GND) U4.L5(GND) U4.L7(GND) U4.L9(GND) U4.L11(GND) U4.L13(GND) U4.L15(GND) U4.L17(GND) U4.L19(GND) U4.L21(GND) U4.L23(GND) U4.L25(GND) U4.L27(GND) U4.L29(GND) U4.M2(GND) U4.M4(GND) U4.M6(GND) U4.M8(GND) U4.M10(GND) U4.M12(GND) U4.M14(GND) U4.M16(GND) U4.M18(GND) U4.M20(GND) U4.M22(GND) U4.M24(GND) U4.M26(GND) U4.M28(GND) U4.M30(GND) U4.N1(GND) U4.N3(GND) U4.N5(GND) U4.N7(GND) U4.N9(GND) U4.N11(GND) U4.N13(GND) U4.N15(GND) U4.N17(GND) U4.N19(GND) U4.N21(GND) U4.N23(GND) U4.N25(GND) U4.N27(GND) U4.N29(GND) U4.P2(GND) U4.P4(GND) U4.P6(GND) U4.P8(GND) U4.P10(GND) U4.P12(GND) U4.P14(GND) U4.P16(GND) U4.P18(GND) U4.P20(GND) U4.P22(GND) U4.P24(GND) U4.P26(GND) U4.P28(GND) U4.P30(GND) U4.R1(GND) U4.R3(GND) U4.R5(GND) U4.R7(GND) U4.R9(GND) U4.R11(GND) U4.R13(GND) U4.R15(GND) U4.R17(GND) U4.R19(GND) U4.R21(GND) U4.R23(GND) U4.R25(GND) U4.R27(GND) U4.R29(GND) U4.T2(GND) U4.T4(GND) U4.T6(GND) U4.T8(GND) U4.T10(GND) U4.T12(GND) U4.T14(GND) U4.T16(GND) U4.T18(GND) U4.T20(GND) U4.T22(GND) U4.T24(GND) U4.T26(GND) U4.T28(GND) U4.T30(GND) U4.U1(GND) U4.U3(GND) U4.U5(GND) U4.U7(GND) U4.U9(GND) U4.U11(GND) U4.U13(GND) U4.U15(GND) U4.U17(GND) U4.U19(GND) U4.U21(GND) U4.U23(GND) U4.U25(GND) U4.U27(GND) U4.U29(GND) U4.V2(GND) U4.V4(GND) U4.V6(GND) U4.V8(GND) U4.V10(GND) U4.V12(GND) U4.V14(GND) U4.V16(GND) U4.V18(GND) U4.V20(GND) U4.V22(GND) U4.V24(GND) U4.V26(GND) U4.V28(GND) U4.V30(GND) U4.W1(GND) U4.W3(GND) U4.W5(GND) U4.W7(GND) U4.W9(GND) U4.W11(GND) U4.W13(GND) U4.W15(GND) U4.W17(GND) U4.W19(GND) U4.W21(GND) U4.W23(GND) U4.W25(GND) U4.W27(GND) U4.W29(GND) U4.Y2(GND) U4.Y4(GND) U4.Y6(GND) U4.Y8(GND) U4.Y10(GND) U4.Y12(GND) U4.Y14(GND) U4.Y16(GND) U4.Y18(GND) U4.Y20(GND) U4.Y22(GND) U4.Y24(GND) U4.Y26(GND) U4.Y28(GND) U4.Y30(GND) U13.A1(GND) U13.A3(GND) U13.A5(GND) U13.A7(GND) U13.A9(GND) U13.A11(GND) U13.A13(GND) U13.A15(GND) U13.A17(GND) U13.A19(GND) U13.A21(GND) U13.A23(GND) U13.A25(GND) U13.A27(GND) U13.A29(GND) U13.AA1(GND) U13.AA3(GND) U13.AA5(GND) U13.AA7(GND) U13.AA9(GND) U13.AA11(GND) U13.AA13(GND) U13.AA15(GND) U13.AA17(GND) U13.AA19(GND) U13.AA21(GND) U13.AA23(GND) U13.AA25(GND) U13.AA27(GND) U13.AA29(GND) U13.AB2(GND) U13.AB4(GND) U13.AB6(GND) U13.AB8(GND) U13.AB10(GND) U13.AB12(GND) U13.AB14(GND) U13.AB16(GND) U13.AB18(GND) U13.AB20(GND) U13.AB22(GND) U13.AB24(GND) U13.AB26(GND) U13.AB28(GND) U13.AB30(GND) U13.AC1(GND) U13.AC3(GND) U13.AC5(GND) U13.AC7(GND) U13.AC9(GND) U13.AC11(GND) U13.AC13(GND) U13.AC15(GND) U13.AC17(GND) U13.AC19(GND) U13.AC21(GND) U13.AC23(GND) U13.AC25(GND) U13.AC27(GND) U13.AC29(GND) U13.AD2(GND) U13.AD4(GND) U13.AD6(GND) U13.AD8(GND) U13.AD10(GND) U13.AD12(GND) U13.AD14(GND) U13.AD16(GND) U13.AD18(GND) U13.AD20(GND) U13.AD22(GND) U13.AD24(GND) U13.AD26(GND) U13.AD28(GND) U13.AD30(GND) U13.AE1(GND) U13.AE3(GND) U13.AE5(GND) U13.AE7(GND) U13.AE9(GND) U13.AE11(GND) U13.AE13(GND) U13.AE15(GND) U13.AE17(GND) U13.AE19(GND) U13.AE21(GND) U13.AE23(GND) U13.AE25(GND) U13.AE27(GND) U13.AE29(GND) U13.AF2(GND) U13.AF4(GND) U13.AF6(GND) U13.AF8(GND) U13.AF10(GND) U13.AF12(GND) U13.AF14(GND) U13.AF16(GND) U13.AF18(GND) U13.AF20(GND) U13.AF22(GND) U13.AF24(GND) U13.AF26(GND) U13.AF28(GND) U13.AF30(GND) U13.AG1(GND) U13.AG3(GND) U13.AG5(GND) U13.AG7(GND) U13.AG9(GND) U13.AG11(GND) U13.AG13(GND) U13.AG15(GND) U13.AG17(GND) U13.AG19(GND) U13.AG21(GND) U13.AG23(GND) U13.AG25(GND) U13.AG27(GND) U13.AG29(GND) U13.AH2(GND) U13.AH4(GND) U13.AH6(GND) U13.AH8(GND) U13.AH10(GND) U13.AH12(GND) U13.AH14(GND) U13.AH16(GND) U13.AH18(GND) U13.AH20(GND) U13.AH22(GND) U13.AH24(GND) U13.AH26(GND) U13.AH28(GND) U13.AH30(GND) U13.AJ1(GND) U13.AJ3(GND) U13.AJ4(GND) U13.AJ6(GND) U13.AJ9(GND) U13.AJ11(GND) U13.AJ17(GND) U13.AJ27(GND) U13.AJ29(GND) U13.AK2(GND) U13.AK14(GND) U13.AK17(GND) U13.AK20(GND) U13.AK23(GND) U13.AK30(GND) U13.B2(GND) U13.B4(GND) U13.B6(GND) U13.B8(GND) U13.B10(GND) U13.B12(GND) U13.B14(GND) U13.B16(GND) U13.B18(GND) U13.B20(GND) U13.B22(GND) U13.B24(GND) U13.B26(GND) U13.B28(GND) U13.B30(GND) U13.C1(GND) U13.C3(GND) U13.C5(GND) U13.C7(GND) U13.C9(GND) U13.C11(GND) U13.C13(GND) U13.C15(GND) U13.C17(GND) U13.C19(GND) U13.C21(GND) U13.C23(GND) U13.C25(GND) U13.C27(GND) U13.C29(GND) U13.D2(GND) U13.D4(GND) U13.D6(GND) U13.D8(GND) U13.D10(GND) U13.D12(GND) U13.D14(GND) U13.D16(GND) U13.D18(GND) U13.D20(GND) U13.D22(GND) U13.D24(GND) U13.D26(GND) U13.D28(GND) U13.D30(GND) U13.E1(GND) U13.E3(GND) U13.E5(GND) U13.E7(GND) U13.E9(GND) U13.E11(GND) U13.E13(GND) U13.E15(GND) U13.E17(GND) U13.E19(GND) U13.E21(GND) U13.E23(GND) U13.E25(GND) U13.E27(GND) U13.E29(GND) U13.F2(GND) U13.F4(GND) U13.F6(GND) U13.F8(GND) U13.F10(GND) U13.F12(GND) U13.F14(GND) U13.F16(GND) U13.F18(GND) U13.F20(GND) U13.F22(GND) U13.F24(GND) U13.F26(GND) U13.F28(GND) U13.F30(GND) U13.G1(GND) U13.G3(GND) U13.G5(GND) U13.G7(GND) U13.G9(GND) U13.G11(GND) U13.G13(GND) U13.G15(GND) U13.G17(GND) U13.G19(GND) U13.G21(GND) U13.G23(GND) U13.G25(GND) U13.G27(GND) U13.G29(GND) U13.H2(GND) U13.H4(GND) U13.H6(GND) U13.H8(GND) U13.H10(GND) U13.H12(GND) U13.H14(GND) U13.H16(GND) U13.H18(GND) U13.H20(GND) U13.H22(GND) U13.H24(GND) U13.H26(GND) U13.H28(GND) U13.H30(GND) U13.J1(GND) U13.J3(GND) U13.J5(GND) U13.J7(GND) U13.J9(GND) U13.J11(GND) U13.J13(GND) U13.J15(GND) U13.J17(GND) U13.J19(GND) U13.J21(GND) U13.J23(GND) U13.J25(GND) U13.J27(GND) U13.J29(GND) U13.K2(GND) U13.K4(GND) U13.K6(GND) U13.K8(GND) U13.K10(GND) U13.K12(GND) U13.K14(GND) U13.K16(GND) U13.K18(GND) U13.K20(GND) U13.K22(GND) U13.K24(GND) U13.K26(GND) U13.K28(GND) U13.K30(GND) U13.L1(GND) U13.L3(GND) U13.L5(GND) U13.L7(GND) U13.L9(GND) U13.L11(GND) U13.L13(GND) U13.L15(GND) U13.L17(GND) U13.L19(GND) U13.L21(GND) U13.L23(GND) U13.L25(GND) U13.L27(GND) U13.L29(GND) U13.M2(GND) U13.M4(GND) U13.M6(GND) U13.M8(GND) U13.M10(GND) U13.M12(GND) U13.M14(GND) U13.M16(GND) U13.M18(GND) U13.M20(GND) U13.M22(GND) U13.M24(GND) U13.M26(GND) U13.M28(GND) U13.M30(GND) U13.N1(GND) U13.N3(GND) U13.N5(GND) U13.N7(GND) U13.N9(GND) U13.N11(GND) U13.N13(GND) U13.N15(GND) U13.N17(GND) U13.N19(GND) U13.N21(GND) U13.N23(GND) U13.N25(GND) U13.N27(GND) U13.N29(GND) U13.P2(GND) U13.P4(GND) U13.P6(GND) U13.P8(GND) U13.P10(GND) U13.P12(GND) U13.P14(GND) U13.P16(GND) U13.P18(GND) U13.P20(GND) U13.P22(GND) U13.P24(GND) U13.P26(GND) U13.P28(GND) U13.P30(GND) U13.R1(GND) U13.R3(GND) U13.R5(GND) U13.R7(GND) U13.R9(GND) U13.R11(GND) U13.R13(GND) U13.R15(GND) U13.R17(GND) U13.R19(GND) U13.R21(GND) U13.R23(GND) U13.R25(GND) U13.R27(GND) U13.R29(GND) U13.T2(GND) U13.T4(GND) U13.T6(GND) U13.T8(GND) U13.T10(GND) U13.T12(GND) U13.T14(GND) U13.T16(GND) U13.T18(GND) U13.T20(GND) U13.T22(GND) U13.T24(GND) U13.T26(GND) U13.T28(GND) U13.T30(GND) U13.U1(GND) U13.U3(GND) U13.U5(GND) U13.U7(GND) U13.U9(GND) U13.U11(GND) U13.U13(GND) U13.U15(GND) U13.U17(GND) U13.U19(GND) U13.U21(GND) U13.U23(GND) U13.U25(GND) U13.U27(GND) U13.U29(GND) U13.V2(GND) U13.V4(GND) U13.V6(GND) U13.V8(GND) U13.V10(GND) U13.V12(GND) U13.V14(GND) U13.V16(GND) U13.V18(GND) U13.V20(GND) U13.V22(GND) U13.V24(GND) U13.V26(GND) U13.V28(GND) U13.V30(GND) U13.W1(GND) U13.W3(GND) U13.W5(GND) U13.W7(GND) U13.W9(GND) U13.W11(GND) U13.W13(GND) U13.W15(GND) U13.W17(GND) U13.W19(GND) U13.W21(GND) U13.W23(GND) U13.W25(GND) U13.W27(GND) U13.W29(GND) U13.Y2(GND) U13.Y4(GND) U13.Y6(GND) U13.Y8(GND) U13.Y10(GND) U13.Y12(GND) U13.Y14(GND) U13.Y16(GND) U13.Y18(GND) U13.Y20(GND) U13.Y22(GND) U13.Y24(GND) U13.Y26(GND) U13.Y28(GND) U13.Y30(GND)
1V: U2.A2(VDD) U2.A4(VDD) U2.A6(VDD) U2.A8(VDD) U2.A10(VDD) U2.A12(VDD) U2.A14(VDD) U2.A16(VDD) U2.A18(VDD) U2.A20(VDD) U2.A22(VDD) U2.A24(VDD) U2.A26(VDD) U2.A28(VDD) U2.A30(VDD) U2.AA2(VDD) U2.AA4(VDD) U2.AA6(VDD) U2.AA8(VDD) U2.AA10(VDD) U2.AA12(VDD) U2.AA14(VDD) U2.AA16(VDD) U2.AA18(VDD) U2.AA20(VDD) U2.AA22(VDD) U2.AA24(VDD) U2.AA26(VDD) U2.AA28(VDD) U2.AA30(VDD) U2.AB1(VDD) U2.AB3(VDD) U2.AB5(VDD) U2.AB7(VDD) U2.AB9(VDD) U2.AB11(VDD) U2.AB13(VDD) U2.AB15(VDD) U2.AB17(VDD) U2.AB19(VDD) U2.AB21(VDD) U2.AB23(VDD) U2.AB25(VDD) U2.AB27(VDD) U2.AB29(VDD) U2.AC2(VDD) U2.AC4(VDD) U2.AC6(VDD) U2.AC8(VDD) U2.AC10(VDD) U2.AC12(VDD) U2.AC14(VDD) U2.AC16(VDD) U2.AC18(VDD) U2.AC20(VDD) U2.AC22(VDD) U2.AC24(VDD) U2.AC26(VDD) U2.AC28(VDD) U2.AC30(VDD) U2.AD1(VDD) U2.AD3(VDD) U2.AD5(VDD) U2.AD7(VDD) U2.AD9(VDD) U2.AD11(VDD) U2.AD13(VDD) U2.AD15(VDD) U2.AD17(VDD) U2.AD19(VDD) U2.AD21(VDD) U2.AD23(VDD) U2.AD25(VDD) U2.AD27(VDD) U2.AD29(VDD) U2.AE2(VDD) U2.AE4(VDD) U2.AE6(VDD) U2.AE8(VDD) U2.AE10(VDD) U2.AE12(VDD) U2.AE14(VDD) U2.AE16(VDD) U2.AE18(VDD) U2.AE20(VDD) U2.AE22(VDD) U2.AE24(VDD) U2.AE26(VDD) U2.AE28(VDD) U2.AE30(VDD) U2.AF1(VDD) U2.AF3(VDD) U2.AF5(VDD) U2.AF7(VDD) U2.AF9(VDD) U2.AF11(VDD) U2.AF13(VDD) U2.AF15(VDD) U2.AF17(VDD) U2.AF19(VDD) U2.AF21(VDD) U2.AF23(VDD) U2.AF25(VDD) U2.AF27(VDD) U2.AF29(VDD) U2.AG2(VDD) U2.AG4(VDD) U2.AG6(VDD) U2.AG8(VDD) U2.AG10(VDD) U2.AG12(VDD) U2.AG14(VDD) U2.AG16(VDD) U2.AG18(VDD) U2.AG20(VDD) U2.AG22(VDD) U2.AG24(VDD) U2.AG26(VDD) U2.AG28(VDD) U2.AG30(VDD) U2.AH1(VDD) U2.AH3(VDD) U2.AH5(VDD) U2.AH7(VDD) U2.AH9(VDD) U2.AH11(VDD) U2.AH13(VDD) U2.AH15(VDD) U2.AH17(VDD) U2.AH19(VDD) U2.AH21(VDD) U2.AH23(VDD) U2.AH25(VDD) U2.AH27(VDD) U2.AH29(VDD) U2.AJ2(VDD) U2.AJ10(VDD) U2.AJ14(VDD) U2.AJ18(VDD) U2.AJ28(VDD) U2.AJ30(VDD) U2.AK1(VDD) U2.AK26(VDD) U2.AK29(VDD) U2.B1(VDD) U2.B3(VDD) U2.B5(VDD) U2.B7(VDD) U2.B9(VDD) U2.B11(VDD) U2.B13(VDD) U2.B15(VDD) U2.B17(VDD) U2.B19(VDD) U2.B21(VDD) U2.B23(VDD) U2.B25(VDD) U2.B27(VDD) U2.B29(VDD) U2.C2(VDD) U2.C4(VDD) U2.C6(VDD) U2.C8(VDD) U2.C10(VDD) U2.C12(VDD) U2.C14(VDD) U2.C16(VDD) U2.C18(VDD) U2.C20(VDD) U2.C22(VDD) U2.C24(VDD) U2.C26(VDD) U2.C28(VDD) U2.C30(VDD) U2.D1(VDD) U2.D3(VDD) U2.D5(VDD) U2.D7(VDD) U2.D9(VDD) U2.D11(VDD) U2.D13(VDD) U2.D15(VDD) U2.D17(VDD) U2.D19(VDD) U2.D21(VDD) U2.D23(VDD) U2.D25(VDD) U2.D27(VDD) U2.D29(VDD) U2.E2(VDD) U2.E4(VDD) U2.E6(VDD) U2.E8(VDD) U2.E10(VDD) U2.E12(VDD) U2.E14(VDD) U2.E16(VDD) U2.E18(VDD) U2.E20(VDD) U2.E22(VDD) U2.E24(VDD) U2.E26(VDD) U2.E28(VDD) U2.E30(VDD) U2.F1(VDD) U2.F3(VDD) U2.F5(VDD) U2.F7(VDD) U2.F9(VDD) U2.F11(VDD) U2.F13(VDD) U2.F15(VDD) U2.F17(VDD) U2.F19(VDD) U2.F21(VDD) U2.F23(VDD) U2.F25(VDD) U2.F27(VDD) U2.F29(VDD) U2.G2(VDD) U2.G4(VDD) U2.G6(VDD) U2.G8(VDD) U2.G10(VDD) U2.G12(VDD) U2.G14(VDD) U2.G16(VDD) U2.G18(VDD) U2.G20(VDD) U2.G22(VDD) U2.G24(VDD) U2.G26(VDD) U2.G28(VDD) U2.G30(VDD) U2.H1(VDD) U2.H3(VDD) U2.H5(VDD) U2.H7(VDD) U2.H9(VDD) U2.H11(VDD) U2.H13(VDD) U2.H15(VDD) U2.H17(VDD) U2.H19(VDD) U2.H21(VDD) U2.H23(VDD) U2.H25(VDD) U2.H27(VDD) U2.H29(VDD) U2.J2(VDD) U2.J4(VDD) U2.J6(VDD) U2.J8(VDD) U2.J10(VDD) U2.J12(VDD) U2.J14(VDD) U2.J16(VDD) U2.J18(VDD) U2.J20(VDD) U2.J22(VDD) U2.J24(VDD) U2.J26(VDD) U2.J28(VDD) U2.J30(VDD) U2.K1(VDD) U2.K3(VDD) U2.K5(VDD) U2.K7(VDD) U2.K9(VDD) U2.K11(VDD) U2.K13(VDD) U2.K15(VDD) U2.K17(VDD) U2.K19(VDD) U2.K21(VDD) U2.K23(VDD) U2.K25(VDD) U2.K27(VDD) U2.K29(VDD) U2.L2(VDD) U2.L4(VDD) U2.L6(VDD) U2.L8(VDD) U2.L10(VDD) U2.L12(VDD) U2.L14(VDD) U2.L16(VDD) U2.L18(VDD) U2.L20(VDD) U2.L22(VDD) U2.L24(VDD) U2.L26(VDD) U2.L28(VDD) U2.L30(VDD) U2.M1(VDD) U2.M3(VDD) U2.M5(VDD) U2.M7(VDD) U2.M9(VDD) U2.M11(VDD) U2.M13(VDD) U2.M15(VDD) U2.M17(VDD) U2.M19(VDD) U2.M21(VDD) U2.M23(VDD) U2.M25(VDD) U2.M27(VDD) U2.M29(VDD) U2.N2(VDD) U2.N4(VDD) U2.N6(VDD) U2.N8(VDD) U2.N10(VDD) U2.N12(VDD) U2.N14(VDD) U2.N16(VDD) U2.N18(VDD) U2.N20(VDD) U2.N22(VDD) U2.N24(VDD) U2.N26(VDD) U2.N28(VDD) U2.N30(VDD) U2.P1(VDD) U2.P3(VDD) U2.P5(VDD) U2.P7(VDD) U2.P9(VDD) U2.P11(VDD) U2.P13(VDD) U2.P15(VDD) U2.P17(VDD) U2.P19(VDD) U2.P21(VDD) U2.P23(VDD) U2.P25(VDD) U2.P27(VDD) U2.P29(VDD) U2.R2(VDD) U2.R4(VDD) U2.R6(VDD) U2.R8(VDD) U2.R10(VDD) U2.R12(VDD) U2.R14(VDD) U2.R16(VDD) U2.R18(VDD) U2.R20(VDD) U2.R22(VDD) U2.R24(VDD) U2.R26(VDD) U2.R28(VDD) U2.R30(VDD) U2.T1(VDD) U2.T3(VDD) U2.T5(VDD) U2.T7(VDD) U2.T9(VDD) U2.T11(VDD) U2.T13(VDD) U2.T15(VDD) U2.T17(VDD) U2.T19(VDD) U2.T21(VDD) U2.T23(VDD) U2.T25(VDD) U2.T27(VDD) U2.T29(VDD) U2.U2(VDD) U2.U4(VDD) U2.U6(VDD) U2.U8(VDD) U2.U10(VDD) U2.U12(VDD) U2.U14(VDD) U2.U16(VDD) U2.U18(VDD) U2.U20(VDD) U2.U22(VDD) U2.U24(VDD) U2.U26(VDD) U2.U28(VDD) U2.U30(VDD) U2.V1(VDD) U2.V3(VDD) U2.V5(VDD) U2.V7(VDD) U2.V9(VDD) U2.V11(VDD) U2.V13(VDD) U2.V15(VDD) U2.V17(VDD) U2.V19(VDD) U2.V21(VDD) U2.V23(VDD) U2.V25(VDD) U2.V27(VDD) U2.V29(VDD) U2.W2(VDD) U2.W4(VDD) U2.W6(VDD) U2.W8(VDD) U2.W10(VDD) U2.W12(VDD) U2.W14(VDD) U2.W16(VDD) U2.W18(VDD) U2.W20(VDD) U2.W22(VDD) U2.W24(VDD) U2.W26(VDD) U2.W28(VDD) U2.W30(VDD) U2.Y1(VDD) U2.Y3(VDD) U2.Y5(VDD) U2.Y7(VDD) U2.Y9(VDD) U2.Y11(VDD) U2.Y13(VDD) U2.Y15(VDD) U2.Y17(VDD) U2.Y19(VDD) U2.Y21(VDD) U2.Y23(VDD) U2.Y25(VDD) U2.Y27(VDD) U2.Y29(VDD) U3.A2(VDD) U3.A4(VDD) U3.A6(VDD) U3.A8(VDD) U3.A10(VDD) U3.A12(VDD) U3.A14(VDD) U3.A16(VDD) U3.A18(VDD) U3.A20(VDD) U3.A22(VDD) U3.A24(VDD) U3.A26(VDD) U3.A28(VDD) U3.A30(VDD) U3.AA2(VDD) U3.AA4(VDD) U3.AA6(VDD) U3.AA8(VDD) U3.AA10(VDD) U3.AA12(VDD) U3.AA14(VDD) U3.AA16(VDD) U3.AA18(VDD) U3.AA20(VDD) U3.AA22(VDD) U3.AA24(VDD) U3.AA26(VDD) U3.AA28(VDD) U3.AA30(VDD) U3.AB1(VDD) U3.AB3(VDD) U3.AB5(VDD) U3.AB7(VDD) U3.AB9(VDD) U3.AB11(VDD) U3.AB13(VDD) U3.AB15(VDD) U3.AB17(VDD) U3.AB19(VDD) U3.AB21(VDD) U3.AB23(VDD) U3.AB25(VDD) U3.AB27(VDD) U3.AB29(VDD) U3.AC2(VDD) U3.AC4(VDD) U3.AC6(VDD) U3.AC8(VDD) U3.AC10(VDD) U3.AC12(VDD) U3.AC14(VDD) U3.AC16(VDD) U3.AC18(VDD) U3.AC20(VDD) U3.AC22(VDD) U3.AC24(VDD) U3.AC26(VDD) U3.AC28(VDD) U3.AC30(VDD) U3.AD1(VDD) U3.AD3(VDD) U3.AD5(VDD) U3.AD7(VDD) U3.AD9(VDD) U3.AD11(VDD) U3.AD13(VDD) U3.AD15(VDD) U3.AD17(VDD) U3.AD19(VDD) U3.AD21(VDD) U3.AD23(VDD) U3.AD25(VDD) U3.AD27(VDD) U3.AD29(VDD) U3.AE2(VDD) U3.AE4(VDD) U3.AE6(VDD) U3.AE8(VDD) U3.AE10(VDD) U3.AE12(VDD) U3.AE14(VDD) U3.AE16(VDD) U3.AE18(VDD) U3.AE20(VDD) U3.AE22(VDD) U3.AE24(VDD) U3.AE26(VDD) U3.AE28(VDD) U3.AE30(VDD) U3.AF1(VDD) U3.AF3(VDD) U3.AF5(VDD) U3.AF7(VDD) U3.AF9(VDD) U3.AF11(VDD) U3.AF13(VDD) U3.AF15(VDD) U3.AF17(VDD) U3.AF19(VDD) U3.AF21(VDD) U3.AF23(VDD) U3.AF25(VDD) U3.AF27(VDD) U3.AF29(VDD) U3.AG2(VDD) U3.AG4(VDD) U3.AG6(VDD) U3.AG8(VDD) U3.AG10(VDD) U3.AG12(VDD) U3.AG14(VDD) U3.AG16(VDD) U3.AG18(VDD) U3.AG20(VDD) U3.AG22(VDD) U3.AG24(VDD) U3.AG26(VDD) U3.AG28(VDD) U3.AG30(VDD) U3.AH1(VDD) U3.AH3(VDD) U3.AH5(VDD) U3.AH7(VDD) U3.AH9(VDD) U3.AH11(VDD) U3.AH13(VDD) U3.AH15(VDD) U3.AH17(VDD) U3.AH19(VDD) U3.AH21(VDD) U3.AH23(VDD) U3.AH25(VDD) U3.AH27(VDD) U3.AH29(VDD) U3.AJ2(VDD) U3.AJ10(VDD) U3.AJ14(VDD) U3.AJ18(VDD) U3.AJ28(VDD) U3.AJ30(VDD) U3.AK1(VDD) U3.AK26(VDD) U3.AK29(VDD) U3.B1(VDD) U3.B3(VDD) U3.B5(VDD) U3.B7(VDD) U3.B9(VDD) U3.B11(VDD) U3.B13(VDD) U3.B15(VDD) U3.B17(VDD) U3.B19(VDD) U3.B21(VDD) U3.B23(VDD) U3.B25(VDD) U3.B27(VDD) U3.B29(VDD) U3.C2(VDD) U3.C4(VDD) U3.C6(VDD) U3.C8(VDD) U3.C10(VDD) U3.C12(VDD) U3.C14(VDD) U3.C16(VDD) U3.C18(VDD) U3.C20(VDD) U3.C22(VDD) U3.C24(VDD) U3.C26(VDD) U3.C28(VDD) U3.C30(VDD) U3.D1(VDD) U3.D3(VDD) U3.D5(VDD) U3.D7(VDD) U3.D9(VDD) U3.D11(VDD) U3.D13(VDD) U3.D15(VDD) U3.D17(VDD) U3.D19(VDD) U3.D21(VDD) U3.D23(VDD) U3.D25(VDD) U3.D27(VDD) U3.D29(VDD) U3.E2(VDD) U3.E4(VDD) U3.E6(VDD) U3.E8(VDD) U3.E10(VDD) U3.E12(VDD) U3.E14(VDD) U3.E16(VDD) U3.E18(VDD) U3.E20(VDD) U3.E22(VDD) U3.E24(VDD) U3.E26(VDD) U3.E28(VDD) U3.E30(VDD) U3.F1(VDD) U3.F3(VDD) U3.F5(VDD) U3.F7(VDD) U3.F9(VDD) U3.F11(VDD) U3.F13(VDD) U3.F15(VDD) U3.F17(VDD) U3.F19(VDD) U3.F21(VDD) U3.F23(VDD) U3.F25(VDD) U3.F27(VDD) U3.F29(VDD) U3.G2(VDD) U3.G4(VDD) U3.G6(VDD) U3.G8(VDD) U3.G10(VDD) U3.G12(VDD) U3.G14(VDD) U3.G16(VDD) U3.G18(VDD) U3.G20(VDD) U3.G22(VDD) U3.G24(VDD) U3.G26(VDD) U3.G28(VDD) U3.G30(VDD) U3.H1(VDD) U3.H3(VDD) U3.H5(VDD) U3.H7(VDD) U3.H9(VDD) U3.H11(VDD) U3.H13(VDD) U3.H15(VDD) U3.H17(VDD) U3.H19(VDD) U3.H21(VDD) U3.H23(VDD) U3.H25(VDD) U3.H27(VDD) U3.H29(VDD) U3.J2(VDD) U3.J4(VDD) U3.J6(VDD) U3.J8(VDD) U3.J10(VDD) U3.J12(VDD) U3.J14(VDD) U3.J16(VDD) U3.J18(VDD) U3.J20(VDD) U3.J22(VDD) U3.J24(VDD) U3.J26(VDD) U3.J28(VDD) U3.J30(VDD) U3.K1(VDD) U3.K3(VDD) U3.K5(VDD) U3.K7(VDD) U3.K9(VDD) U3.K11(VDD) U3.K13(VDD) U3.K15(VDD) U3.K17(VDD) U3.K19(VDD) U3.K21(VDD) U3.K23(VDD) U3.K25(VDD) U3.K27(VDD) U3.K29(VDD) U3.L2(VDD) U3.L4(VDD) U3.L6(VDD) U3.L8(VDD) U3.L10(VDD) U3.L12(VDD) U3.L14(VDD) U3.L16(VDD) U3.L18(VDD) U3.L20(VDD) U3.L22(VDD) U3.L24(VDD) U3.L26(VDD) U3.L28(VDD) U3.L30(VDD) U3.M1(VDD) U3.M3(VDD) U3.M5(VDD) U3.M7(VDD) U3.M9(VDD) U3.M11(VDD) U3.M13(VDD) U3.M15(VDD) U3.M17(VDD) U3.M19(VDD) U3.M21(VDD) U3.M23(VDD) U3.M25(VDD) U3.M27(VDD) U3.M29(VDD) U3.N2(VDD) U3.N4(VDD) U3.N6(VDD) U3.N8(VDD) U3.N10(VDD) U3.N12(VDD) U3.N14(VDD) U3.N16(VDD) U3.N18(VDD) U3.N20(VDD) U3.N22(VDD) U3.N24(VDD) U3.N26(VDD) U3.N28(VDD) U3.N30(VDD) U3.P1(VDD) U3.P3(VDD) U3.P5(VDD) U3.P7(VDD) U3.P9(VDD) U3.P11(VDD) U3.P13(VDD) U3.P15(VDD) U3.P17(VDD) U3.P19(VDD) U3.P21(VDD) U3.P23(VDD) U3.P25(VDD) U3.P27(VDD) U3.P29(VDD) U3.R2(VDD) U3.R4(VDD) U3.R6(VDD) U3.R8(VDD) U3.R10(VDD) U3.R12(VDD) U3.R14(VDD) U3.R16(VDD) U3.R18(VDD) U3.R20(VDD) U3.R22(VDD) U3.R24(VDD) U3.R26(VDD) U3.R28(VDD) U3.R30(VDD) U3.T1(VDD) U3.T3(VDD) U3.T5(VDD) U3.T7(VDD) U3.T9(VDD) U3.T11(VDD) U3.T13(VDD) U3.T15(VDD) U3.T17(VDD) U3.T19(VDD) U3.T21(VDD) U3.T23(VDD) U3.T25(VDD) U3.T27(VDD) U3.T29(VDD) U3.U2(VDD) U3.U4(VDD) U3.U6(VDD) U3.U8(VDD) U3.U10(VDD) U3.U12(VDD) U3.U14(VDD) U3.U16(VDD) U3.U18(VDD) U3.U20(VDD) U3.U22(VDD) U3.U24(VDD) U3.U26(VDD) U3.U28(VDD) U3.U30(VDD) U3.V1(VDD) U3.V3(VDD) U3.V5(VDD) U3.V7(VDD) U3.V9(VDD) U3.V11(VDD) U3.V13(VDD) U3.V15(VDD) U3.V17(VDD) U3.V19(VDD) U3.V21(VDD) U3.V23(VDD) U3.V25(VDD) U3.V27(VDD) U3.V29(VDD) U3.W2(VDD) U3.W4(VDD) U3.W6(VDD) U3.W8(VDD) U3.W10(VDD) U3.W12(VDD) U3.W14(VDD) U3.W16(VDD) U3.W18(VDD) U3.W20(VDD) U3.W22(VDD) U3.W24(VDD) U3.W26(VDD) U3.W28(VDD) U3.W30(VDD) U3.Y1(VDD) U3.Y3(VDD) U3.Y5(VDD) U3.Y7(VDD) U3.Y9(VDD) U3.Y11(VDD) U3.Y13(VDD) U3.Y15(VDD) U3.Y17(VDD) U3.Y19(VDD) U3.Y21(VDD) U3.Y23(VDD) U3.Y25(VDD) U3.Y27(VDD) U3.Y29(VDD) U4.A2(VDD) U4.A4(VDD) U4.A6(VDD) U4.A8(VDD) U4.A10(VDD) U4.A12(VDD) U4.A14(VDD) U4.A16(VDD) U4.A18(VDD) U4.A20(VDD) U4.A22(VDD) U4.A24(VDD) U4.A26(VDD) U4.A28(VDD) U4.A30(VDD) U4.AA2(VDD) U4.AA4(VDD) U4.AA6(VDD) U4.AA8(VDD) U4.AA10(VDD) U4.AA12(VDD) U4.AA14(VDD) U4.AA16(VDD) U4.AA18(VDD) U4.AA20(VDD) U4.AA22(VDD) U4.AA24(VDD) U4.AA26(VDD) U4.AA28(VDD) U4.AA30(VDD) U4.AB1(VDD) U4.AB3(VDD) U4.AB5(VDD) U4.AB7(VDD) U4.AB9(VDD) U4.AB11(VDD) U4.AB13(VDD) U4.AB15(VDD) U4.AB17(VDD) U4.AB19(VDD) U4.AB21(VDD) U4.AB23(VDD) U4.AB25(VDD) U4.AB27(VDD) U4.AB29(VDD) U4.AC2(VDD) U4.AC4(VDD) U4.AC6(VDD) U4.AC8(VDD) U4.AC10(VDD) U4.AC12(VDD) U4.AC14(VDD) U4.AC16(VDD) U4.AC18(VDD) U4.AC20(VDD) U4.AC22(VDD) U4.AC24(VDD) U4.AC26(VDD) U4.AC28(VDD) U4.AC30(VDD) U4.AD1(VDD) U4.AD3(VDD) U4.AD5(VDD) U4.AD7(VDD) U4.AD9(VDD) U4.AD11(VDD) U4.AD13(VDD) U4.AD15(VDD) U4.AD17(VDD) U4.AD19(VDD) U4.AD21(VDD) U4.AD23(VDD) U4.AD25(VDD) U4.AD27(VDD) U4.AD29(VDD) U4.AE2(VDD) U4.AE4(VDD) U4.AE6(VDD) U4.AE8(VDD) U4.AE10(VDD) U4.AE12(VDD) U4.AE14(VDD) U4.AE16(VDD) U4.AE18(VDD) U4.AE20(VDD) U4.AE22(VDD) U4.AE24(VDD) U4.AE26(VDD) U4.AE28(VDD) U4.AE30(VDD) U4.AF1(VDD) U4.AF3(VDD) U4.AF5(VDD) U4.AF7(VDD) U4.AF9(VDD) U4.AF11(VDD) U4.AF13(VDD) U4.AF15(VDD) U4.AF17(VDD) U4.AF19(VDD) U4.AF21(VDD) U4.AF23(VDD) U4.AF25(VDD) U4.AF27(VDD) U4.AF29(VDD) U4.AG2(VDD) U4.AG4(VDD) U4.AG6(VDD) U4.AG8(VDD) U4.AG10(VDD) U4.AG12(VDD) U4.AG14(VDD) U4.AG16(VDD) U4.AG18(VDD) U4.AG20(VDD) U4.AG22(VDD) U4.AG24(VDD) U4.AG26(VDD) U4.AG28(VDD) U4.AG30(VDD) U4.AH1(VDD) U4.AH3(VDD) U4.AH5(VDD) U4.AH7(VDD) U4.AH9(VDD) U4.AH11(VDD) U4.AH13(VDD) U4.AH15(VDD) U4.AH17(VDD) U4.AH19(VDD) U4.AH21(VDD) U4.AH23(VDD) U4.AH25(VDD) U4.AH27(VDD) U4.AH29(VDD) U4.AJ2(VDD) U4.AJ10(VDD) U4.AJ14(VDD) U4.AJ18(VDD) U4.AJ28(VDD) U4.AJ30(VDD) U4.AK1(VDD) U4.AK26(VDD) U4.AK29(VDD) U4.B1(VDD) U4.B3(VDD) U4.B5(VDD) U4.B7(VDD) U4.B9(VDD) U4.B11(VDD) U4.B13(VDD) U4.B15(VDD) U4.B17(VDD) U4.B19(VDD) U4.B21(VDD) U4.B23(VDD) U4.B25(VDD) U4.B27(VDD) U4.B29(VDD) U4.C2(VDD) U4.C4(VDD) U4.C6(VDD) U4.C8(VDD) U4.C10(VDD) U4.C12(VDD) U4.C14(VDD) U4.C16(VDD) U4.C18(VDD) U4.C20(VDD) U4.C22(VDD) U4.C24(VDD) U4.C26(VDD) U4.C28(VDD) U4.C30(VDD) U4.D1(VDD) U4.D3(VDD) U4.D5(VDD) U4.D7(VDD) U4.D9(VDD) U4.D11(VDD) U4.D13(VDD) U4.D15(VDD) U4.D17(VDD) U4.D19(VDD) U4.D21(VDD) U4.D23(VDD) U4.D25(VDD) U4.D27(VDD) U4.D29(VDD) U4.E2(VDD) U4.E4(VDD) U4.E6(VDD) U4.E8(VDD) U4.E10(VDD) U4.E12(VDD) U4.E14(VDD) U4.E16(VDD) U4.E18(VDD) U4.E20(VDD) U4.E22(VDD) U4.E24(VDD) U4.E26(VDD) U4.E28(VDD) U4.E30(VDD) U4.F1(VDD) U4.F3(VDD) U4.F5(VDD) U4.F7(VDD) U4.F9(VDD) U4.F11(VDD) U4.F13(VDD) U4.F15(VDD) U4.F17(VDD) U4.F19(VDD) U4.F21(VDD) U4.F23(VDD) U4.F25(VDD) U4.F27(VDD) U4.F29(VDD) U4.G2(VDD) U4.G4(VDD) U4.G6(VDD) U4.G8(VDD) U4.G10(VDD) U4.G12(VDD) U4.G14(VDD) U4.G16(VDD) U4.G18(VDD) U4.G20(VDD) U4.G22(VDD) U4.G24(VDD) U4.G26(VDD) U4.G28(VDD) U4.G30(VDD) U4.H1(VDD) U4.H3(VDD) U4.H5(VDD) U4.H7(VDD) U4.H9(VDD) U4.H11(VDD) U4.H13(VDD) U4.H15(VDD) U4.H17(VDD) U4.H19(VDD) U4.H21(VDD) U4.H23(VDD) U4.H25(VDD) U4.H27(VDD) U4.H29(VDD) U4.J2(VDD) U4.J4(VDD) U4.J6(VDD) U4.J8(VDD) U4.J10(VDD) U4.J12(VDD) U4.J14(VDD) U4.J16(VDD) U4.J18(VDD) U4.J20(VDD) U4.J22(VDD) U4.J24(VDD) U4.J26(VDD) U4.J28(VDD) U4.J30(VDD) U4.K1(VDD) U4.K3(VDD) U4.K5(VDD) U4.K7(VDD) U4.K9(VDD) U4.K11(VDD) U4.K13(VDD) U4.K15(VDD) U4.K17(VDD) U4.K19(VDD) U4.K21(VDD) U4.K23(VDD) U4.K25(VDD) U4.K27(VDD) U4.K29(VDD) U4.L2(VDD) U4.L4(VDD) U4.L6(VDD) U4.L8(VDD) U4.L10(VDD) U4.L12(VDD) U4.L14(VDD) U4.L16(VDD) U4.L18(VDD) U4.L20(VDD) U4.L22(VDD) U4.L24(VDD) U4.L26(VDD) U4.L28(VDD) U4.L30(VDD) U4.M1(VDD) U4.M3(VDD) U4.M5(VDD) U4.M7(VDD) U4.M9(VDD) U4.M11(VDD) U4.M13(VDD) U4.M15(VDD) U4.M17(VDD) U4.M19(VDD) U4.M21(VDD) U4.M23(VDD) U4.M25(VDD) U4.M27(VDD) U4.M29(VDD) U4.N2(VDD) U4.N4(VDD) U4.N6(VDD) U4.N8(VDD) U4.N10(VDD) U4.N12(VDD) U4.N14(VDD) U4.N16(VDD) U4.N18(VDD) U4.N20(VDD) U4.N22(VDD) U4.N24(VDD) U4.N26(VDD) U4.N28(VDD) U4.N30(VDD) U4.P1(VDD) U4.P3(VDD) U4.P5(VDD) U4.P7(VDD) U4.P9(VDD) U4.P11(VDD) U4.P13(VDD) U4.P15(VDD) U4.P17(VDD) U4.P19(VDD) U4.P21(VDD) U4.P23(VDD) U4.P25(VDD) U4.P27(VDD) U4.P29(VDD) U4.R2(VDD) U4.R4(VDD) U4.R6(VDD) U4.R8(VDD) U4.R10(VDD) U4.R12(VDD) U4.R14(VDD) U4.R16(VDD) U4.R18(VDD) U4.R20(VDD) U4.R22(VDD) U4.R24(VDD) U4.R26(VDD) U4.R28(VDD) U4.R30(VDD) U4.T1(VDD) U4.T3(VDD) U4.T5(VDD) U4.T7(VDD) U4.T9(VDD) U4.T11(VDD) U4.T13(VDD) U4.T15(VDD) U4.T17(VDD) U4.T19(VDD) U4.T21(VDD) U4.T23(VDD) U4.T25(VDD) U4.T27(VDD) U4.T29(VDD) U4.U2(VDD) U4.U4(VDD) U4.U6(VDD) U4.U8(VDD) U4.U10(VDD) U4.U12(VDD) U4.U14(VDD) U4.U16(VDD) U4.U18(VDD) U4.U20(VDD) U4.U22(VDD) U4.U24(VDD) U4.U26(VDD) U4.U28(VDD) U4.U30(VDD) U4.V1(VDD) U4.V3(VDD) U4.V5(VDD) U4.V7(VDD) U4.V9(VDD) U4.V11(VDD) U4.V13(VDD) U4.V15(VDD) U4.V17(VDD) U4.V19(VDD) U4.V21(VDD) U4.V23(VDD) U4.V25(VDD) U4.V27(VDD) U4.V29(VDD) U4.W2(VDD) U4.W4(VDD) U4.W6(VDD) U4.W8(VDD) U4.W10(VDD) U4.W12(VDD) U4.W14(VDD) U4.W16(VDD) U4.W18(VDD) U4.W20(VDD) U4.W22(VDD) U4.W24(VDD) U4.W26(VDD) U4.W28(VDD) U4.W30(VDD) U4.Y1(VDD) U4.Y3(VDD) U4.Y5(VDD) U4.Y7(VDD) U4.Y9(VDD) U4.Y11(VDD) U4.Y13(VDD) U4.Y15(VDD) U4.Y17(VDD) U4.Y19(VDD) U4.Y21(VDD) U4.Y23(VDD) U4.Y25(VDD) U4.Y27(VDD) U4.Y29(VDD) U13.A2(VDD) U13.A4(VDD) U13.A6(VDD) U13.A8(VDD) U13.A10(VDD) U13.A12(VDD) U13.A14(VDD) U13.A16(VDD) U13.A18(VDD) U13.A20(VDD) U13.A22(VDD) U13.A24(VDD) U13.A26(VDD) U13.A28(VDD) U13.A30(VDD) U13.AA2(VDD) U13.AA4(VDD) U13.AA6(VDD) U13.AA8(VDD) U13.AA10(VDD) U13.AA12(VDD) U13.AA14(VDD) U13.AA16(VDD) U13.AA18(VDD) U13.AA20(VDD) U13.AA22(VDD) U13.AA24(VDD) U13.AA26(VDD) U13.AA28(VDD) U13.AA30(VDD) U13.AB1(VDD) U13.AB3(VDD) U13.AB5(VDD) U13.AB7(VDD) U13.AB9(VDD) U13.AB11(VDD) U13.AB13(VDD) U13.AB15(VDD) U13.AB17(VDD) U13.AB19(VDD) U13.AB21(VDD) U13.AB23(VDD) U13.AB25(VDD) U13.AB27(VDD) U13.AB29(VDD) U13.AC2(VDD) U13.AC4(VDD) U13.AC6(VDD) U13.AC8(VDD) U13.AC10(VDD) U13.AC12(VDD) U13.AC14(VDD) U13.AC16(VDD) U13.AC18(VDD) U13.AC20(VDD) U13.AC22(VDD) U13.AC24(VDD) U13.AC26(VDD) U13.AC28(VDD) U13.AC30(VDD) U13.AD1(VDD) U13.AD3(VDD) U13.AD5(VDD) U13.AD7(VDD) U13.AD9(VDD) U13.AD11(VDD) U13.AD13(VDD) U13.AD15(VDD) U13.AD17(VDD) U13.AD19(VDD) U13.AD21(VDD) U13.AD23(VDD) U13.AD25(VDD) U13.AD27(VDD) U13.AD29(VDD) U13.AE2(VDD) U13.AE4(VDD) U13.AE6(VDD) U13.AE8(VDD) U13.AE10(VDD) U13.AE12(VDD) U13.AE14(VDD) U13.AE16(VDD) U13.AE18(VDD) U13.AE20(VDD) U13.AE22(VDD) U13.AE24(VDD) U13.AE26(VDD) U13.AE28(VDD) U13.AE30(VDD) U13.AF1(VDD) U13.AF3(VDD) U13.AF5(VDD) U13.AF7(VDD) U13.AF9(VDD) U13.AF11(VDD) U13.AF13(VDD) U13.AF15(VDD) U13.AF17(VDD) U13.AF19(VDD) U13.AF21(VDD) U13.AF23(VDD) U13.AF25(VDD) U13.AF27(VDD) U13.AF29(VDD) U13.AG2(VDD) U13.AG4(VDD) U13.AG6(VDD) U13.AG8(VDD) U13.AG10(VDD) U13.AG12(VDD) U13.AG14(VDD) U13.AG16(VDD) U13.AG18(VDD) U13.AG20(VDD) U13.AG22(VDD) U13.AG24(VDD) U13.AG26(VDD) U13.AG28(VDD) U13.AG30(VDD) U13.AH1(VDD) U13.AH3(VDD) U13.AH5(VDD) U13.AH7(VDD) U13.AH9(VDD) U13.AH11(VDD) U13.AH13(VDD) U13.AH15(VDD) U13.AH17(VDD) U13.AH19(VDD) U13.AH21(VDD) U13.AH23(VDD) U13.AH25(VDD) U13.AH27(VDD) U13.AH29(VDD) U13.AJ2(VDD) U13.AJ10(VDD) U13.AJ14(VDD) U13.AJ18(VDD) U13.AJ28(VDD) U13.AJ30(VDD) U13.AK1(VDD) U13.AK26(VDD) U13.AK29(VDD) U13.B1(VDD) U13.B3(VDD) U13.B5(VDD) U13.B7(VDD) U13.B9(VDD) U13.B11(VDD) U13.B13(VDD) U13.B15(VDD) U13.B17(VDD) U13.B19(VDD) U13.B21(VDD) U13.B23(VDD) U13.B25(VDD) U13.B27(VDD) U13.B29(VDD) U13.C2(VDD) U13.C4(VDD) U13.C6(VDD) U13.C8(VDD) U13.C10(VDD) U13.C12(VDD) U13.C14(VDD) U13.C16(VDD) U13.C18(VDD) U13.C20(VDD) U13.C22(VDD) U13.C24(VDD) U13.C26(VDD) U13.C28(VDD) U13.C30(VDD) U13.D1(VDD) U13.D3(VDD) U13.D5(VDD) U13.D7(VDD) U13.D9(VDD) U13.D11(VDD) U13.D13(VDD) U13.D15(VDD) U13.D17(VDD) U13.D19(VDD) U13.D21(VDD) U13.D23(VDD) U13.D25(VDD) U13.D27(VDD) U13.D29(VDD) U13.E2(VDD) U13.E4(VDD) U13.E6(VDD) U13.E8(VDD) U13.E10(VDD) U13.E12(VDD) U13.E14(VDD) U13.E16(VDD) U13.E18(VDD) U13.E20(VDD) U13.E22(VDD) U13.E24(VDD) U13.E26(VDD) U13.E28(VDD) U13.E30(VDD) U13.F1(VDD) U13.F3(VDD) U13.F5(VDD) U13.F7(VDD) U13.F9(VDD) U13.F11(VDD) U13.F13(VDD) U13.F15(VDD) U13.F17(VDD) U13.F19(VDD) U13.F21(VDD) U13.F23(VDD) U13.F25(VDD) U13.F27(VDD) U13.F29(VDD) U13.G2(VDD) U13.G4(VDD) U13.G6(VDD) U13.G8(VDD) U13.G10(VDD) U13.G12(VDD) U13.G14(VDD) U13.G16(VDD) U13.G18(VDD) U13.G20(VDD) U13.G22(VDD) U13.G24(VDD) U13.G26(VDD) U13.G28(VDD) U13.G30(VDD) U13.H1(VDD) U13.H3(VDD) U13.H5(VDD) U13.H7(VDD) U13.H9(VDD) U13.H11(VDD) U13.H13(VDD) U13.H15(VDD) U13.H17(VDD) U13.H19(VDD) U13.H21(VDD) U13.H23(VDD) U13.H25(VDD) U13.H27(VDD) U13.H29(VDD) U13.J2(VDD) U13.J4(VDD) U13.J6(VDD) U13.J8(VDD) U13.J10(VDD) U13.J12(VDD) U13.J14(VDD) U13.J16(VDD) U13.J18(VDD) U13.J20(VDD) U13.J22(VDD) U13.J24(VDD) U13.J26(VDD) U13.J28(VDD) U13.J30(VDD) U13.K1(VDD) U13.K3(VDD) U13.K5(VDD) U13.K7(VDD) U13.K9(VDD) U13.K11(VDD) U13.K13(VDD) U13.K15(VDD) U13.K17(VDD) U13.K19(VDD) U13.K21(VDD) U13.K23(VDD) U13.K25(VDD) U13.K27(VDD) U13.K29(VDD) U13.L2(VDD) U13.L4(VDD) U13.L6(VDD) U13.L8(VDD) U13.L10(VDD) U13.L12(VDD) U13.L14(VDD) U13.L16(VDD) U13.L18(VDD) U13.L20(VDD) U13.L22(VDD) U13.L24(VDD) U13.L26(VDD) U13.L28(VDD) U13.L30(VDD) U13.M1(VDD) U13.M3(VDD) U13.M5(VDD) U13.M7(VDD) U13.M9(VDD) U13.M11(VDD) U13.M13(VDD) U13.M15(VDD) U13.M17(VDD) U13.M19(VDD) U13.M21(VDD) U13.M23(VDD) U13.M25(VDD) U13.M27(VDD) U13.M29(VDD) U13.N2(VDD) U13.N4(VDD) U13.N6(VDD) U13.N8(VDD) U13.N10(VDD) U13.N12(VDD) U13.N14(VDD) U13.N16(VDD) U13.N18(VDD) U13.N20(VDD) U13.N22(VDD) U13.N24(VDD) U13.N26(VDD) U13.N28(VDD) U13.N30(VDD) U13.P1(VDD) U13.P3(VDD) U13.P5(VDD) U13.P7(VDD) U13.P9(VDD) U13.P11(VDD) U13.P13(VDD) U13.P15(VDD) U13.P17(VDD) U13.P19(VDD) U13.P21(VDD) U13.P23(VDD) U13.P25(VDD) U13.P27(VDD) U13.P29(VDD) U13.R2(VDD) U13.R4(VDD) U13.R6(VDD) U13.R8(VDD) U13.R10(VDD) U13.R12(VDD) U13.R14(VDD) U13.R16(VDD) U13.R18(VDD) U13.R20(VDD) U13.R22(VDD) U13.R24(VDD) U13.R26(VDD) U13.R28(VDD) U13.R30(VDD) U13.T1(VDD) U13.T3(VDD) U13.T5(VDD) U13.T7(VDD) U13.T9(VDD) U13.T11(VDD) U13.T13(VDD) U13.T15(VDD) U13.T17(VDD) U13.T19(VDD) U13.T21(VDD) U13.T23(VDD) U13.T25(VDD) U13.T27(VDD) U13.T29(VDD) U13.U2(VDD) U13.U4(VDD) U13.U6(VDD) U13.U8(VDD) U13.U10(VDD) U13.U12(VDD) U13.U14(VDD) U13.U16(VDD) U13.U18(VDD) U13.U20(VDD) U13.U22(VDD) U13.U24(VDD) U13.U26(VDD) U13.U28(VDD) U13.U30(VDD) U13.V1(VDD) U13.V3(VDD) U13.V5(VDD) U13.V7(VDD) U13.V9(VDD) U13.V11(VDD) U13.V13(VDD) U13.V15(VDD) U13.V17(VDD) U13.V19(VDD) U13.V21(VDD) U13.V23(VDD) U13.V25(VDD) U13.V27(VDD) U13.V29(VDD) U13.W2(VDD) U13.W4(VDD) U13.W6(VDD) U13.W8(VDD) U13.W10(VDD) U13.W12(VDD) U13.W14(VDD) U13.W16(VDD) U13.W18(VDD) U13.W20(VDD) U13.W22(VDD) U13.W24(VDD) U13.W26(VDD) U13.W28(VDD) U13.W30(VDD) U13.Y1(VDD) U13.Y3(VDD) U13.Y5(VDD) U13.Y7(VDD) U13.Y9(VDD) U13.Y11(VDD) U13.Y13(VDD) U13.Y15(VDD) U13.Y17(VDD) U13.Y19(VDD) U13.Y21(VDD) U13.Y23(VDD) U13.Y25(VDD) U13.Y27(VDD) U13.Y29(VDD) ; port 1V

### Library data of the parts
U2-U4 U13 = Minion 99s256: DB_PCB_DEVICE: SMD_BGA900C80P30X30

## Nets that join several sheets
GND: CPU_Logic (225 pins), MCU (83 pins), SMPS (576 pins), VDD_GND (1740 pins)